# EasyEDA Pro project ProPrj_3x3motorFPGA_2025-06-07.epro, board PCB1
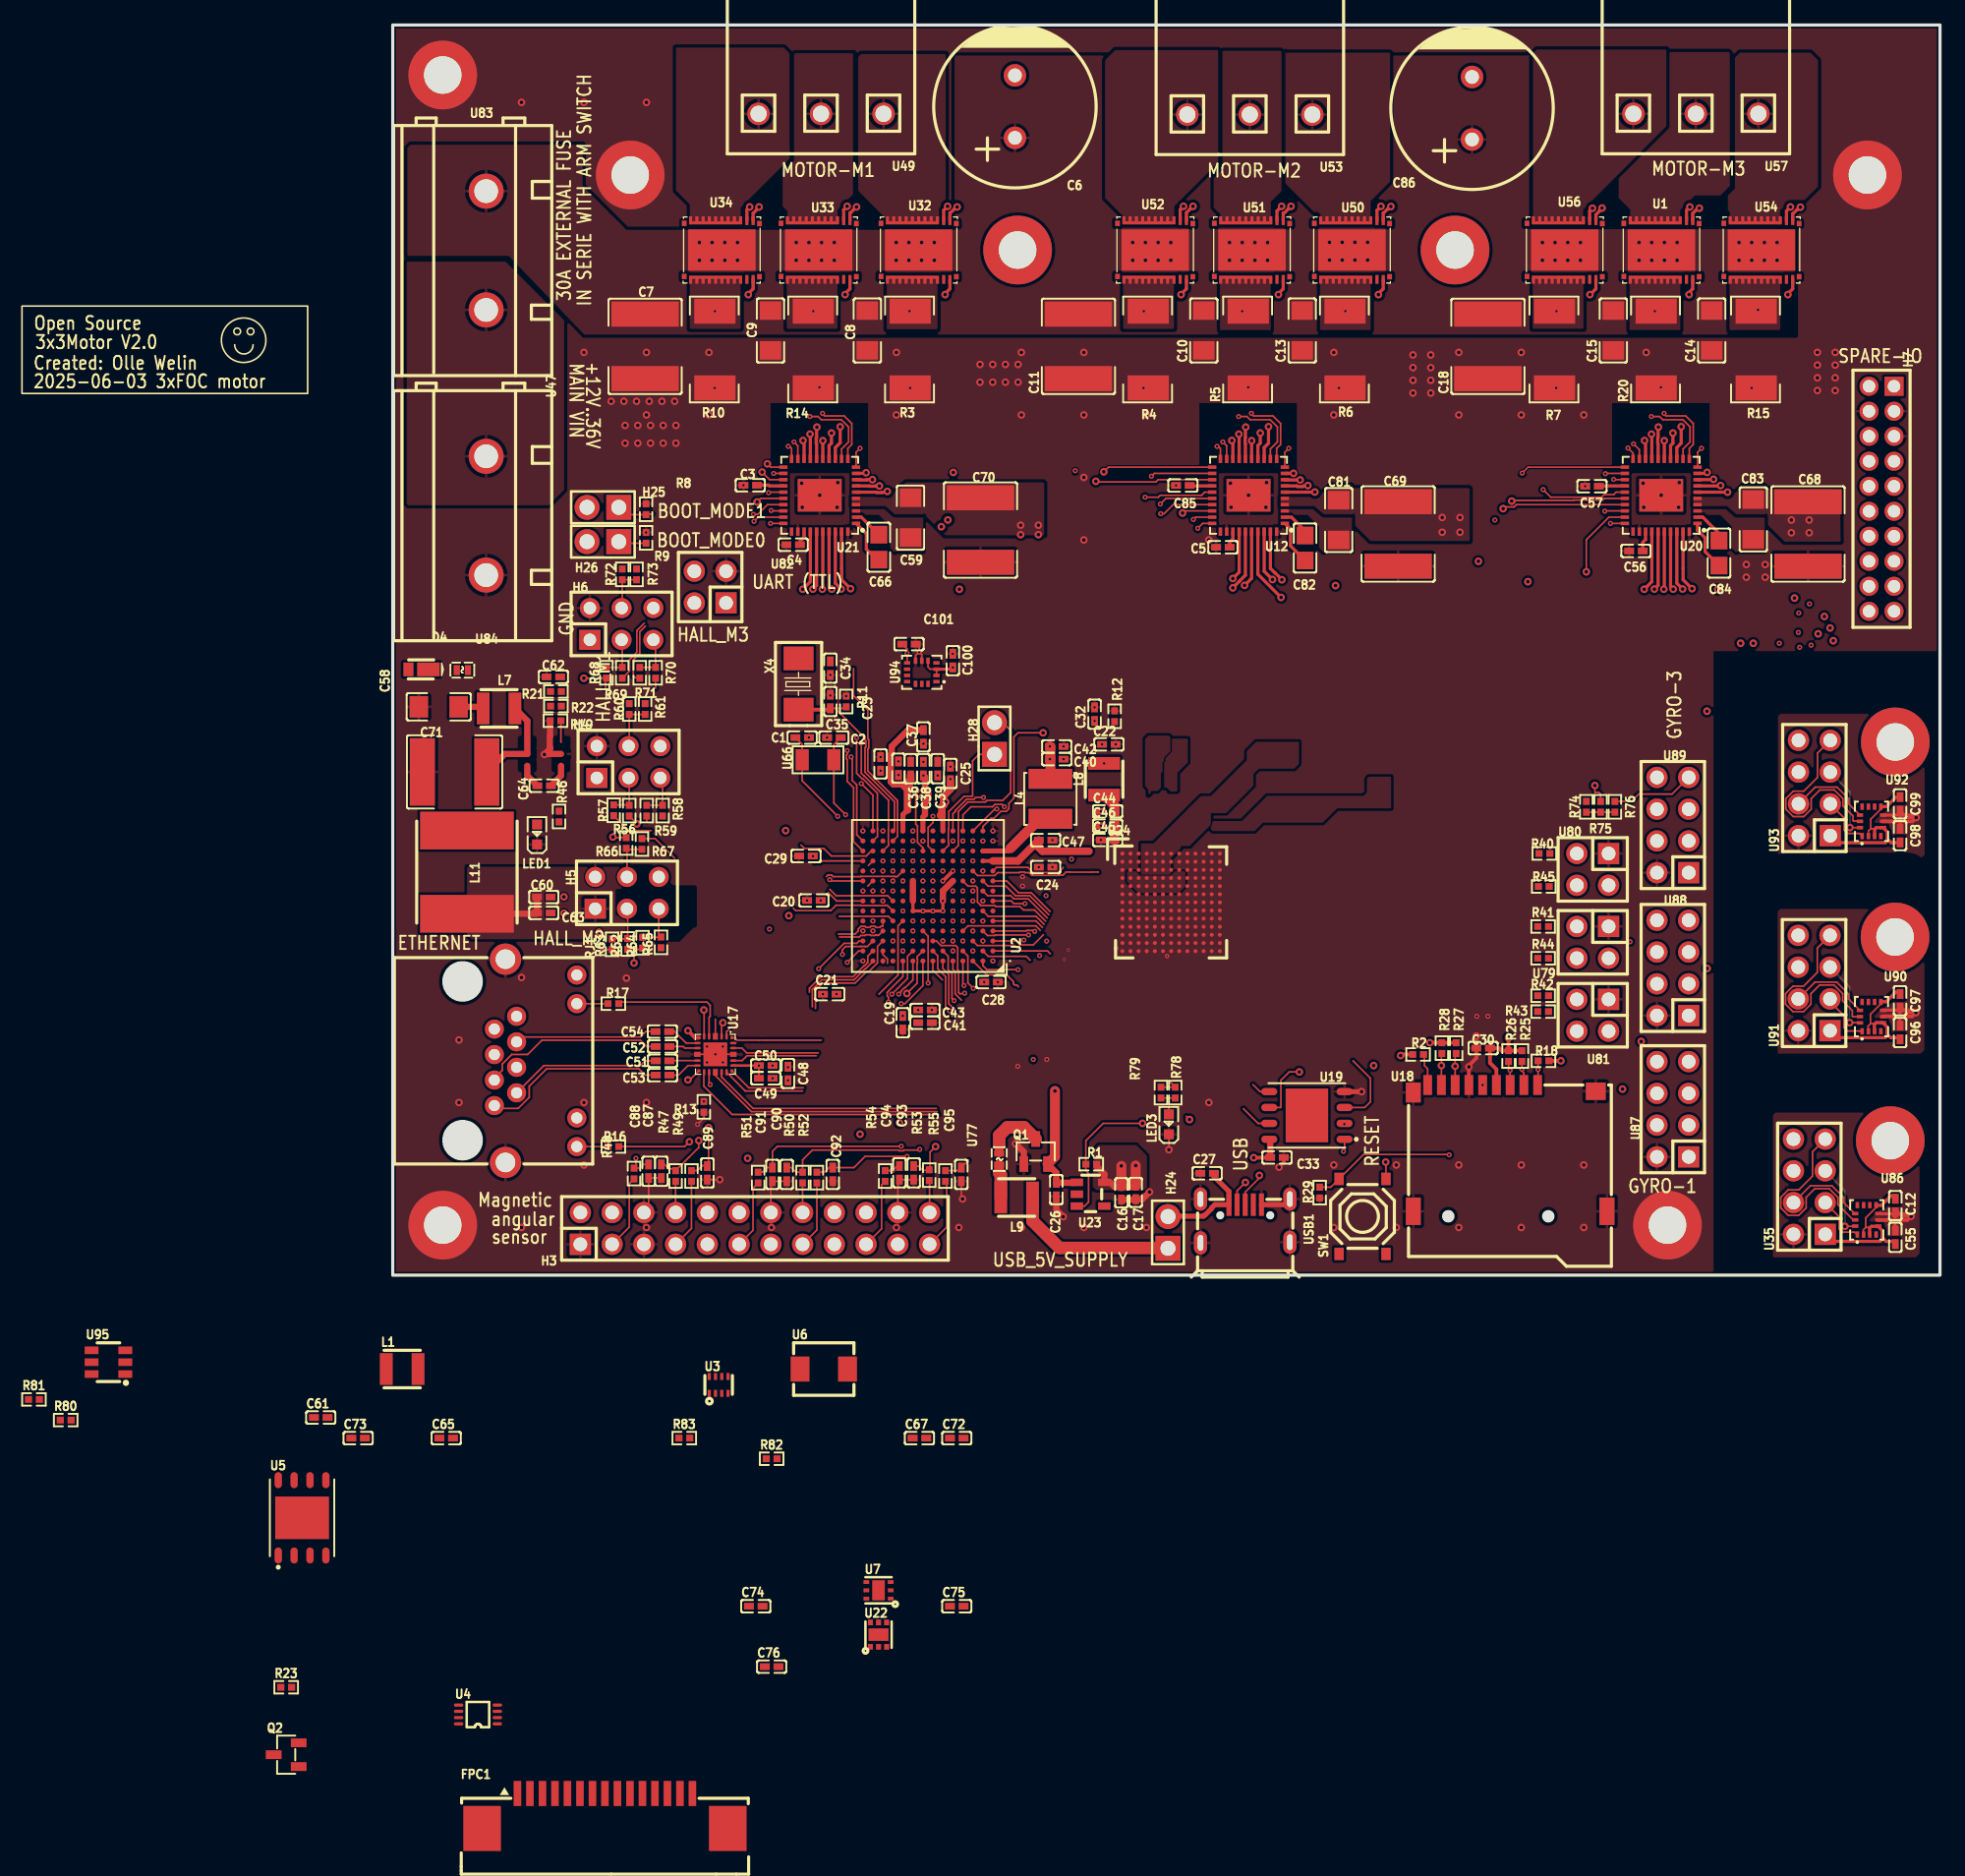
[diagram p5: board, top side]
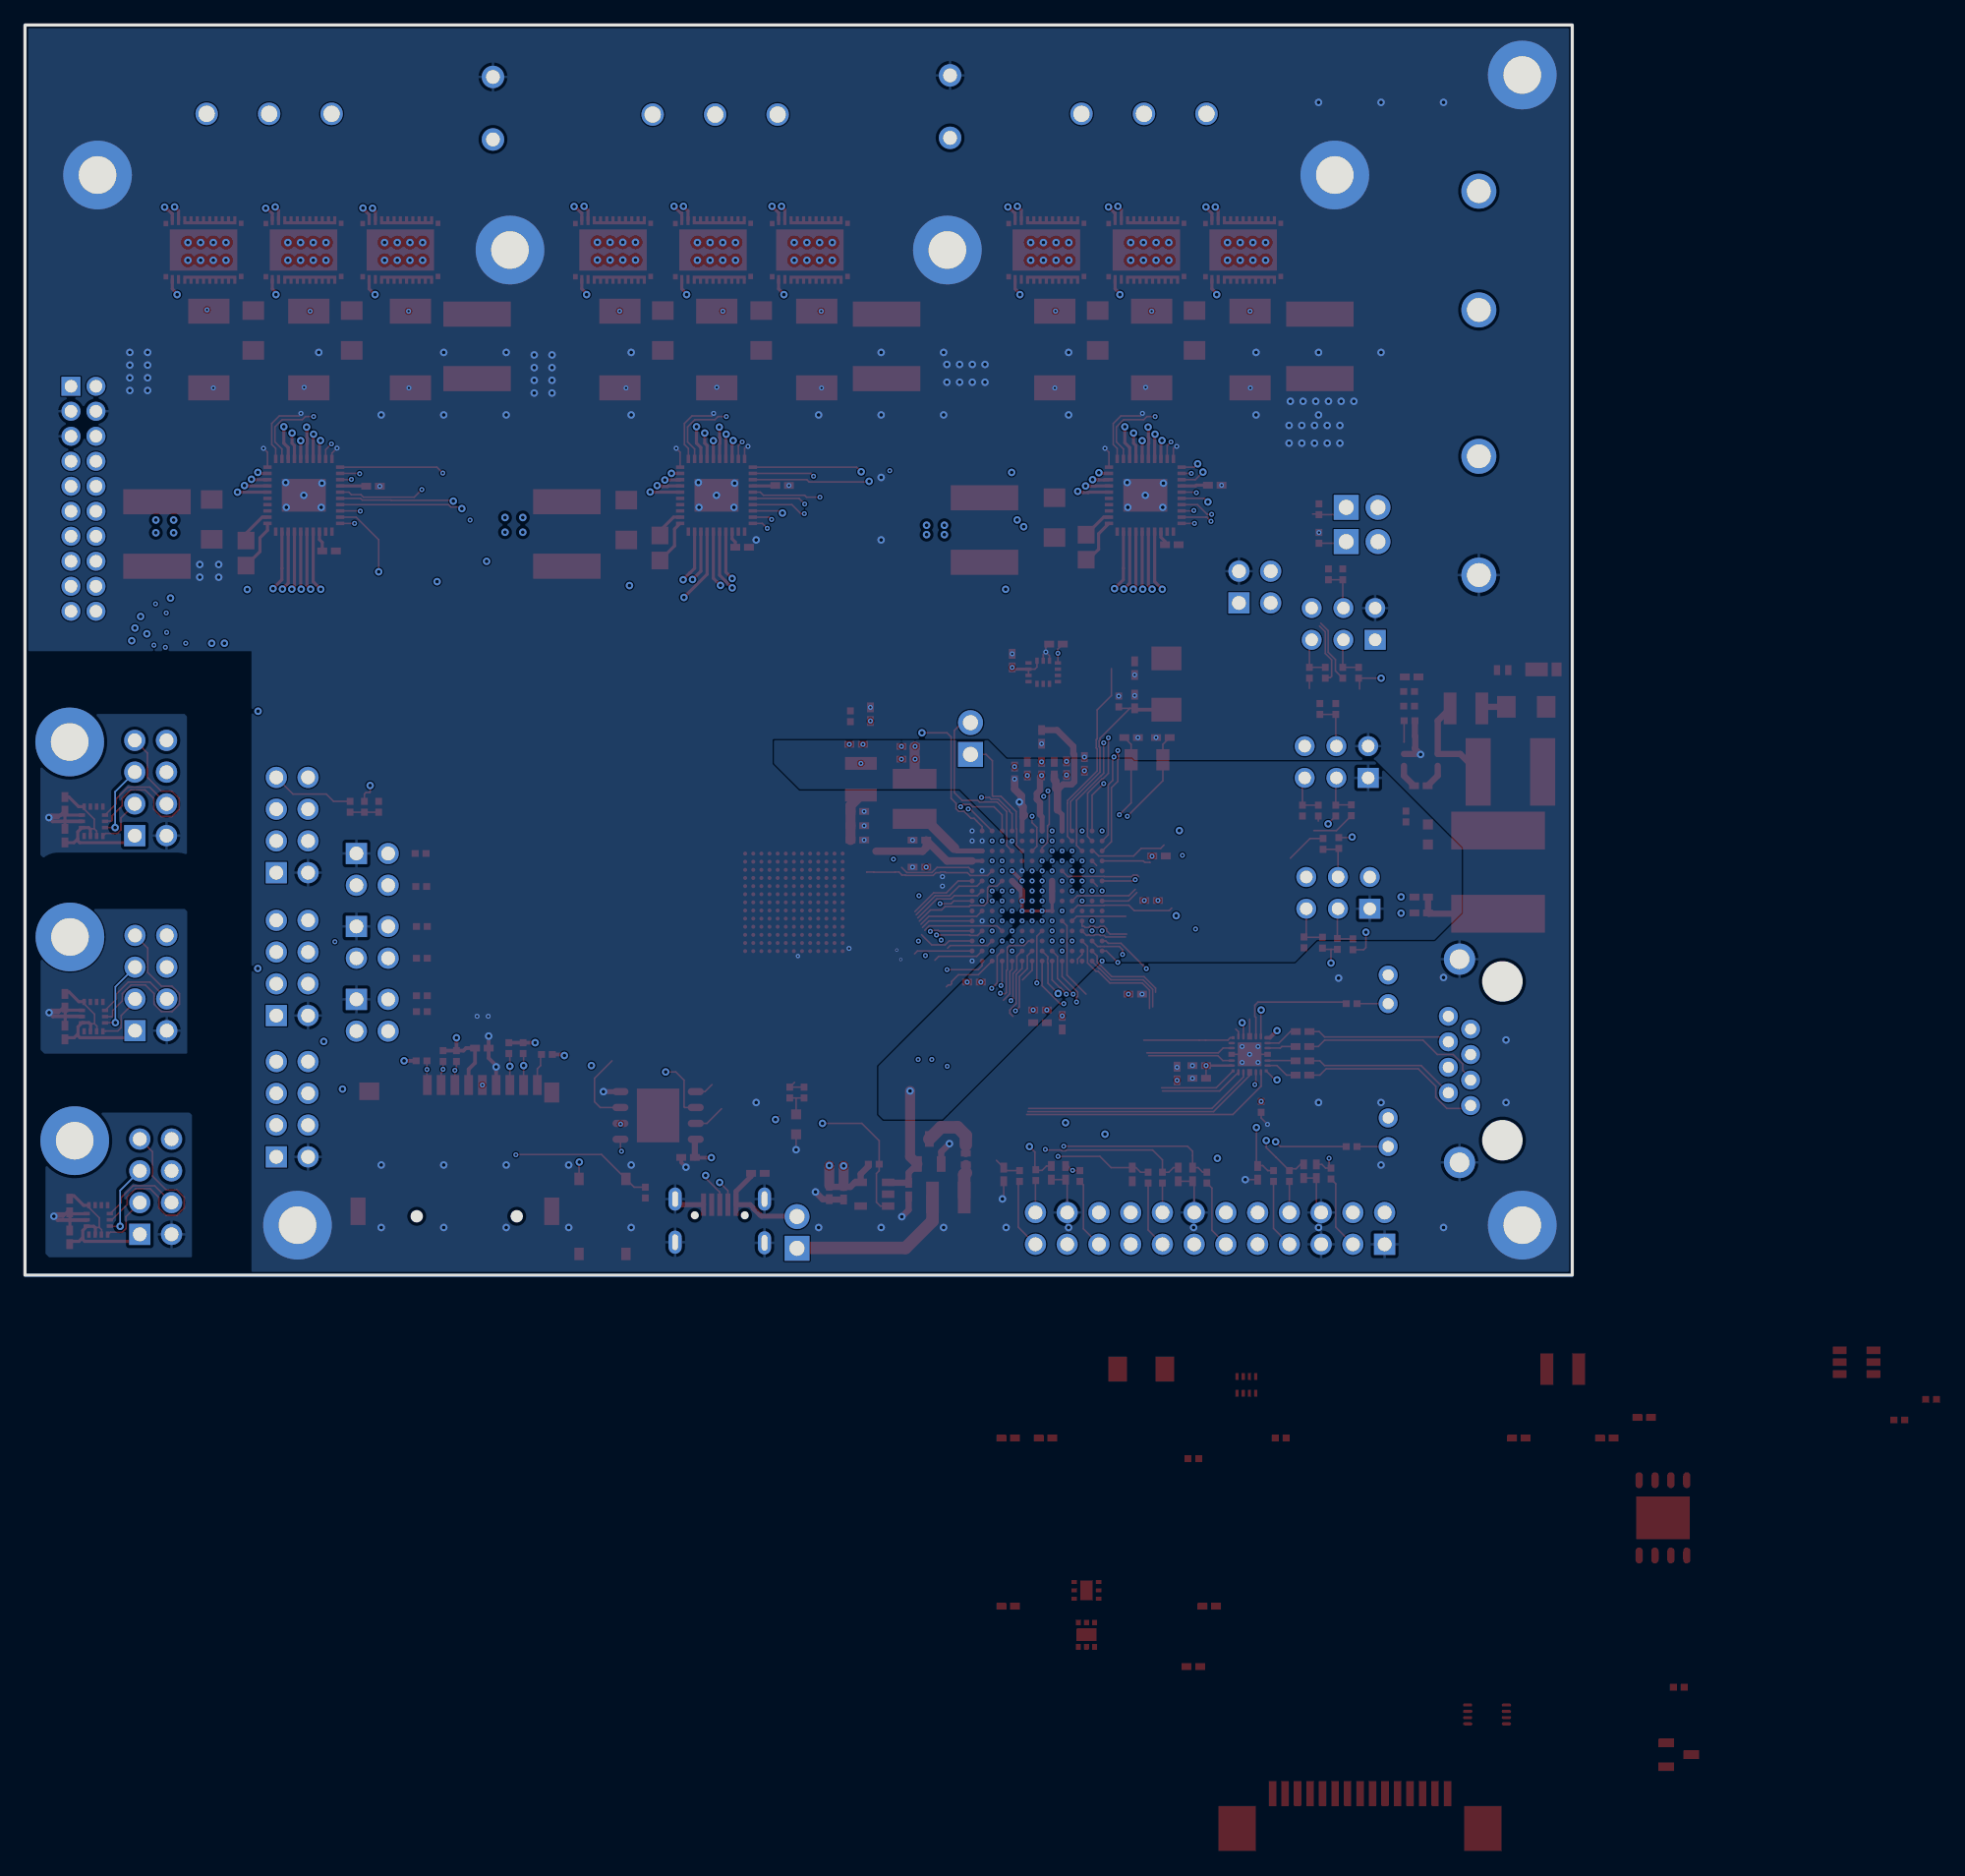
[diagram p6: board, bottom side, seen from below]

Outline 123.81 x 100 mm; copper layers: Top Layer, Inner1, Inner2, Inner3, Inner4, Bottom Layer. Coordinates in mm from the lower left corner of the outline.
Outline path: rectangle 0,100 123.81,0
Stack: Top Layer 0.035mm Outer layer thickness 1oz / Dielectric1 0.0994mm 3313 RC57% 4.2mil / Inner1 0.0152mm Inner layer thickness / Dielectric2 0.55mm 0.55mm H/H No copper / Inner2 0.0152mm Inner layer thickness / Dielectric3 0.1088mm 2116 RC54% 4.9mil / Inner3 0.0152mm Inner layer thickness / Dielectric4 0.55mm 0.55mm H/H No copper / Inner4 0.0152mm Inner layer thickness / Dielectric5 0.0994mm 3313 RC57% 4.2mil / Bottom Layer 0.035mm Outer layer thickness 1oz

## Design rules (mm)
template: Custom Config
spacing copperThickness1oz (default): track to track 0.102, other pairs 0.102 to 0.3
spacing copperThickness2oz: track to track 0.203, other pairs 0.152 to 0.3
track width copperThickness1oz (default): min 0.127, default 0.127, max 2.54
track width copperThickness2oz: min 0.203, default 0.254, max 2.54
differential pair differentialPair (default): width min 0.127, default 0.254, max 2.54; gap min 0.152, default 0.152
differential pair differentialPair100ohm_L1_L2: width min 0.122, default 0.122, max 0.122; gap min 0.203, default 0.203
via viaSize (default): diameter min 0.4, default 0.6, max 10; hole min 0.2, default 0.3, max 6.3
net 36V uses copperRegion_36V
net $1N29938 uses copperRegion_36V
net GND-1 uses copperRegion_36V
net GND-3 uses copperRegion_36V
['net', '36v'] ['NET', '3.3V-1'] uses default
pour e3166 uses copperRegion_36V
pour e3154 uses copperRegion_36V
pour e3189 uses copperRegion_36V
pour e3203 uses copperRegion_36V
pour e3228 uses copperRegion_36V
pour e3209 uses copperRegion_36V
pour e3242 uses copperRegion_36V
pour e3249 uses copperRegion_36V
pour e3261 uses copperRegion_36V
pour e3272 uses copperRegion_36V
pour e9195 uses copperRegion_36V
pour e9346 uses GND_top

## Placement (name value [footprint] x y rotation side)
C1  12pF  [C0402]  32.76 43 0 top
C2  12pF  [C0402]  35.3 43 180 top
C3  100nF  [C0402]  28.61 63.19 180 top
C4  4.7uF  [C0402]  32.04 58.43 180 top
C5  4.7uF  [C0402]  66.42 58.23 180 top
C6  1000uF  [CAP-TH_BD13.0-P5.00-D0.6-FD]  49.78 93.47 90 top
C7  22uF  [C2220]  20.19 74.3 90 top
C8  1uF  [C1206]  37.97 75.56 90 top
C9  1uF  [C1206]  30.23 75.56 90 top
C10  1uF  [C1206]  64.9 75.56 90 top
C11  22uF  [C2220]  54.86 74.3 90 top
C12  4.7uF  [C0402]  120.23 5.57 90 top
C13  1uF  [C1206]  72.77 75.56 90 top
C14  1uF  [C1206]  105.54 75.56 90 top
C15  1uF  [C1206]  97.66 75.56 90 top
C16  4.7uF  [C0402]  58.3 6.59 90 top
C17  4.7uF  [C0402]  59.45 6.62 90 top
C18  22uF  [C2220]  87.63 74.3 90 top
C19  100nF  [C0402]  40.81 20.19 90 top
C20  100nF  [C0402]  33.7 29.97 0 top
C21  100nF  [C0402]  34.97 22.48 0 top
C22  100nF  [C0402]  57.3 42.46 180 top
C23  100nF  [C0402]  39.03 40.89 270 top
C24  100nF  [C0402]  52.24 32.64 180 top
C25  100nF  [C0402]  44.62 40.13 270 top
C26  100nF  [C0402]  53.1 6.84 90 top
C27  4.7uF  [C0402]  65.16 8.15 0 top
C28  100nF  [C0402]  47.87 23.44 180 top
C29  4.7uF  [C0402]  33.06 33.53 0 top
C30  100nF  [C0402]  87.25 18.16 180 top
C31  100nF  [C0402]  40.47 40.55 270 top
C32  100nF  [C0402]  56.16 44.87 90 top
C33  100nF  [C0402]  70.75 9.42 0 top
C34  12pF  [C0402]  35.01 48.55 270 top
C35  12pF  [C0402]  35.01 45.89 90 top
C36  4.7uF  [C0402]  41.44 40.51 270 top
C37  100nF  [C0402]  42.46 43.05 90 top
C38  4.7uF  [C0402]  42.46 40.51 270 top
C39  100nF  [C0402]  43.6 40.51 270 top
C40  4.7uF  [C0402]  53.13 41.28 0 top
C41  4.7uF  [C0402]  42.59 20.19 0 top
C42  4.7uF  [C0402]  53.13 42.29 0 top
C43  100nF  [C0402]  42.59 21.21 0 top
C44  4.7uF  [C0402]  57.2 37.09 180 top
C45  4.7uF  [C0402]  57.2 34.81 180 top
C46  4.7uF  [C0402]  57.2 35.95 180 top
C47  100nF  [C0402]  52.24 34.8 0 top
C48  4.7uF  [C0402]  31.62 16.13 90 top
C49  4.7uF  [C0402]  29.84 15.75 0 top
C50  100nF  [C0402]  29.84 16.76 0 top
C51  33nF  [C0402]  21.59 17.15 0 top
C52  33nF  [C0402]  21.59 18.29 0 top
C53  33nF  [C0402]  21.59 16 0 top
C54  33nF  [C0402]  21.57 19.48 0 top
C55  100nF  [C0402]  120.23 3.03 270 top
C56  4.7uF  [C0402]  99.47 57.93 180 top
C57  100nF  [C0402]  95.96 63.11 180 top
C58  1uF  [C1206]  3.68 45.46 0 top
C59  1uF  [C1206]  41.43 60.59 90 top
C60  4.7uF  [C0402]  12.09 30.24 0 top
C61  100nF  [C0402]  -5.76 -11.39 0 top
C62  4.7uF  [C0402]  12.85 47.85 180 top
C63  4.7uF  [C0402]  12.09 28.97 0 top
C64  100nF  [C0402]  12.12 39.15 0 top
C65  4.7uF  [C0402]  4.28 -13.03 0 top
C66  22nF  [C0805]  38.9 58.23 90 top
C67  4.7uF  [C0402]  42.14 -13.03 0 top
C68  22uF  [C2220]  113.24 59.28 270 top
C69  22uF  [C2220]  80.45 59.29 270 top
C70  22uF  [C2220]  47.03 59.6 270 top
C71  22uF  [C2220]  4.95 40.25 0 top
C72  4.7uF  [C0402]  45.13 -13.03 0 top
C73  100nF  [C0402]  -2.77 -13.03 0 top
C74  100nF  [C0402]  29.05 -26.48 0 top
C75  4.7uF  [C0402]  45.13 -26.48 0 top
C76  100nF  [C0402]  30.32 -31.32 0 top
C81  1uF  [C1206]  75.69 60.4 90 top
C82  22nF  [C0805]  73 58.17 90 top
C83  1uF  [C1206]  108.86 60.45 90 top
C84  22nF  [C0805]  106.12 57.76 90 top
C85  100nF  [C0402]  63.22 63.17 180 top
C86  1000uF  [CAP-TH_BD13.0-P5.00-D0.6-FD]  86.36 93.34 90 top
C87  4.7nF  [C0402]  21.49 8.31 270 top
C88  4.7nF  [C0402]  20.47 8.31 270 top
C89  4.7nF  [C0402]  25.17 8.18 270 top
C90  4.7nF  [C0402]  31.52 8.06 270 top
C91  4.7nF  [C0402]  30.38 8.06 270 top
C92  4.7nF  [C0402]  35.21 8.06 270 top
C93  4.7nF  [C0402]  41.68 8.18 270 top
C94  4.7nF  [C0402]  40.54 8.18 270 top
C95  4.7nF  [C0402]  45.49 8.06 270 top
C96  100nF  [C0402]  120.61 19.41 270 top
C97  4.7uF  [C0402]  120.61 21.95 90 top
C98  100nF  [C0402]  120.61 35.16 270 top
C99  4.7uF  [C0402]  120.61 37.7 90 top
C100  100nF  [C0402]  44.82 49.16 270 top
C101  4.7uF  [C0402]  41.31 50.48 180 top
D4  RB160VAM-60TR  [TUMD2M_L2.0-W1.4-LS2.5-RD]  2.05 48.46 180 top
FPC1  1-84952-5  [FPC-SMD_15P-P1.00_TE_1-84952-5]  16.98 -42.86 0 top
H3  HX PZ2.54-2x12P ZZ  [HDR-TH_24P-P2.54-V-M-R2-C12-S2.54]  28.98 3.74 0 top
H4  排母/2.54mm2x3直排母袋装环保  [HDR-TH_6P-P2.54-V-F-R2-C3-S2.54]  18.87 41.05 0 top
H5  排母/2.54mm2x3直排母袋装环保  [HDR-TH_6P-P2.54-V-F-R2-C3-S2.54]  18.74 30.58 0 top
H6  排母/2.54mm2x3直排母袋装环保  [HDR-TH_6P-P2.54-V-F-R2-C3-S2.54]  18.31 52.09 0 top
H7  2.0-210-SMT-Pin  [HDR-TH_20P-P2.00-V-F-R2-C10-S2.00]  119.13 62.1 270 top
H24  PZ254-1-02-Z-8.5  [HDR-TH_2P-P2.54-V-M]  62.03 3.42 90 top
H25  PZ254-1-02-Z-8.5  [HDR-TH_2P-P2.54-V-M]  16.81 61.42 180 top
H26  PZ254-1-02-Z-8.5  [HDR-TH_2P-P2.54-V-M]  16.81 58.67 180 top
H28  PZ254-1-02-Z-8.5  [HDR-TH_2P-P2.54-V-M]  48.15 42.93 90 top
L1  120nH  [IND-SMD_L2.9-W2.5]  0.75 -7.51 0 top
L4  4.7uH  [IND-SMD_L4.0-W4.0]  52.62 38.1 90 top
L7  120nH  [IND-SMD_L2.9-W2.5]  8.5 45.33 180 top
L8  120nH  [IND-SMD_L2.9-W2.5]  56.92 39.67 90 top
L9  120nH  [IND-SMD_L2.9-W2.5]  49.92 6.21 180 top
L11  33uH  [IND-SMD_L8.0-W8.0]  5.94 32.24 90 top
LED1  KT-0603R  [LED0603-RD]  11.55 35.25 90 top
LED3  KT-0603R  [LED0603-RD]  62.1 12.06 90 top
NOREF  -  [Pad_e320]  120.23 42.65 90 top
NOREF#2  -  [Pad_e323]  119.83 10.76 90 top
NOREF#3  -  [Pad_e238]  4 96 0 top
NOREF#4  -  [Pad_e93]  85 82 0 top
NOREF#5  -  [Pad_e39]  50 82 0 top
NOREF#6  -  [Pad_e242]  4 4 0 top
NOREF#7  -  [Pad_e240]  102 4 0 top
NOREF#8  -  [Pad_e94]  118 88 0 top
NOREF#9  -  [Pad_e32]  19 88 0 top
NOREF#10  -  [Pad_e321]  120.21 27.05 90 top
Q1  DMG2305UX-7  [SOT-23-3_L2.9-W1.3-P1.90-LS2.4-BR]  51.44 9.89 270 top
Q2  BSS138  [SOT-23-3_L2.9-W1.3-P1.90-LS2.4-BR-1]  -8.53 -38.36 0 top
R1  100kΩ  [R0402]  55.89 8.88 0 top
R2  100kΩ  [R0402]  82.04 17.65 180 top
R3  20mΩ  [RES-SMD_L6.4-W3.2-R2512]  41.4 74.04 90 top
R4  20mΩ  [RES-SMD_L6.4-W3.2-R2512]  60.45 74.04 90 top
R5  20mΩ  [RES-SMD_L6.4-W3.2-R2512]  68.45 74.04 90 top
R6  20mΩ  [RES-SMD_L6.4-W3.2-R2512]  76.2 74.04 90 top
R7  20mΩ  [RES-SMD_L6.4-W3.2-R2512]  92.96 74.04 90 top
R8  47kΩ  [R0402]  20.27 61.27 90 top
R9  47kΩ  [R0402]  20.27 58.98 270 top
R10  20mΩ  [RES-SMD_L6.4-W3.2-R2512]  25.78 74.04 90 top
R11  2.2MΩ  [R0402]  36.28 45.89 90 top
R12  1kΩ  [R0402]  57.76 44.7 270 top
R13  6.49kΩ  [R0402]  24.89 13.46 90 top
R14  20mΩ  [RES-SMD_L6.4-W3.2-R2512]  33.66 74.04 90 top
R15  20mΩ  [RES-SMD_L6.4-W3.2-R2512]  109.09 74.04 90 top
R16  150Ω  [R0402]  17.65 10.29 0 top
R17  150Ω  [R0402]  17.65 21.72 0 top
R18  47kΩ  [R0402]  92.07 17.15 0 top
R19  20kΩ  [R0402]  13.02 44.35 0 top
R20  20mΩ  [RES-SMD_L6.4-W3.2-R2512]  101.09 74.04 90 top
R21  100kΩ  [R0402]  13.06 46.69 0 top
R22  4.7kΩ  [R0402]  13.06 45.52 180 top
R23  4.7kΩ  [R0402]  -8.53 -32.97 0 top
R25  47kΩ  [R0402]  90.35 17.53 90 top
R26  47kΩ  [R0402]  89.28 17.53 90 top
R27  47kΩ  [R0402]  85.09 18.16 90 top
R28  47kΩ  [R0402]  83.95 18.16 90 top
R29  47kΩ  [R0402]  74.17 6.6 90 top
R40  1kΩ  [R0402]  92.15 33.73 0 top
R41  1kΩ  [R0402]  92.05 27.89 0 top
R42  1kΩ  [R0402]  92.05 22.35 0 top
R43  1kΩ  [R0402]  92.05 21.08 0 top
R44  1kΩ  [R0402]  92.05 25.35 0 top
R45  1kΩ  [R0402]  92.1 31.09 0 top
R46  1kΩ  [R0402]  13.31 36.69 270 top
R47  4.7kΩ  [R0402]  22.63 7.93 270 top
R48  4.7kΩ  [R0402]  19.3 8.13 270 top
R49  4.7kΩ  [R0402]  23.9 7.93 270 top
R50  4.7kΩ  [R0402]  32.79 7.8 270 top
R51  4.7kΩ  [R0402]  29.24 7.8 270 top
R52  4.7kΩ  [R0402]  33.94 7.8 270 top
R53  4.7kΩ  [R0402]  42.93 8 270 top
R54  4.7kΩ  [R0402]  39.4 7.93 270 top
R55  4.7kΩ  [R0402]  44.22 7.93 270 top
R56  4.7kΩ  [R0402]  18.92 37.16 270 top
R57  1kΩ  [R0402]  17.68 37.19 90 top
R58  4.7kΩ  [R0402]  21.59 37.16 270 top
R59  1kΩ  [R0402]  20.32 37.16 90 top
R60  4.7kΩ  [R0402]  18.92 45.29 90 top
R61  1kΩ  [R0402]  20.19 45.29 270 top
R62  4.7kΩ  [R0402]  18.8 26.49 270 top
R63  1kΩ  [R0402]  17.55 26.46 90 top
R64  4.7kΩ  [R0402]  19.99 26.59 270 top
R65  1kΩ  [R0402]  21.46 26.62 90 top
R66  4.7kΩ  [R0402]  18.68 34.57 90 top
R67  1kΩ  [R0402]  19.94 34.49 270 top
R68  4.7kΩ  [R0402]  17.09 48.18 270 top
R69  1kΩ  [R0402]  18.36 48.18 90 top
R70  4.7kΩ  [R0402]  21.03 48.18 270 top
R71  1kΩ  [R0402]  19.76 48.18 90 top
R72  4.7kΩ  [R0402]  18.36 56.06 90 top
R73  1kΩ  [R0402]  19.51 56.06 270 top
R74  4.7kΩ  [R0402]  95.5 37.47 90 top
R75  4.7kΩ  [R0402]  96.65 37.47 90 top
R76  4.7kΩ  [R0402]  97.79 37.47 90 top
R78  1kΩ  [R0402]  62.61 14.6 270 top
R79  1kΩ  [R0402]  61.47 14.6 270 top
R80  22Ω  [R0402]  -26.17 -11.59 0 top
R81  22Ω  [R0402]  -28.71 -9.94 0 top
R82  10kΩ  [R0402]  30.32 -14.69 0 top
R83  4.7kΩ  [R0402]  23.33 -13.03 0 top
RJ1  RJHSE5384  [RJ45-TH_RJHSE5384]  11.43 17.15 270 top
SW1  TS-1187A-B-A-B  [SW-SMD_4P-L5.1-W5.1-P3.70-LS6.5-TL_H1.5]  77.6 4.7 90 top
U1  CSD88599Q5DC  [SON-22_L5.0-W6.0-P0.50-CSD88599Q5DCT]  101.52 82 270 top
U2  MIMXRT1062DVJ6B  [LFBGA-196_L12.0-W12.0-R14-C14-P0.80-BL]  42.82 30.33 90 top
U3  TPS62840DLCR  [VSON-8_L2.0-W1.5-P0.50-BL]  26.08 -8.78 0 top
U4  PCA9306DC1  [VSSOP-8_L2.4-W2.1-P0.50-LS3.2-BR]  6.82 -35.14 0 top
U5  W25Q64JVZPIQ  [WSON-8_L6.0-W5.0-P1.27-BL-EP]  -7.26 -19.41 0 top
U6  2.2uH  [IND-SMD_L4.7-W4.2]  34.49 -7.51 0 top
U7  TLV75518PDRVR  [WSON-6_L2.0-W2.0-P0.65-BR-EP]  38.87 -25.21 0 top
U12  DRV8304SRHAR  [VQFN-40_L6.0-W6.0-P0.50-TL-EP]  68.47 62.38 180 top
U17  DP83825IRMQR  [HVQFN-24_L3.0-W3.0-P0.40-TL-EP1.9]  25.81 17.66 270 top
U18  A-MicroTF-1.85A  [TF-SMD_A-MICROTF-1.85A]  89.41 10.16 0 top
U19  W25Q64JVZPIQ  [WSON-8_L6.0-W5.0-P1.27-BL-EP]  73.15 12.78 90 top
U20  DRV8304SRHAR  [VQFN-40_L6.0-W6.0-P0.50-TL-EP]  101.5 62.38 180 top
U21  DRV8304SRHAR  [VQFN-40_L6.0-W6.0-P0.50-TL-EP]  34.16 62.38 180 top
U22  TLV75525PDRVR  [WSON-6_L2.0-W2.0-P0.65-BL-EP]  38.87 -28.76 0 top
U23  TLV75733PDBVR  [SOT-23-5_L2.9-W1.6-P0.95-LS2.8-BL]  55.84 6.47 270 top
U24  T20F169C4  [FBGA-169_L9.0-W9.0-R13-C13-P0.65-TL]  62.28 29.82 0 top
U32  CSD88599Q5DC  [SON-22_L5.0-W6.0-P0.50-CSD88599Q5DCT]  42.08 82 270 top
U33  CSD88599Q5DC  [SON-22_L5.0-W6.0-P0.50-CSD88599Q5DCT]  34.08 82 270 top
U34  CSD88599Q5DC  [SON-22_L5.0-W6.0-P0.50-CSD88599Q5DCT]  26.33 82 270 top
U35  PZ2.54-2*4  [HDR-TH_8P-P2.54-V-M-R2-C4-S2.54]  113.35 7.07 90 top
U47  MX950T-9.5-02P-GN01-Cu-PS-A  [CONN-TH_2P-P9.50_DB910-9.52-2P]  7.47 60.75 270 top
U49  KF332K-5.0-3P  [CONN-TH_KF332K-5.0-3P]  34.27 92.9 180 top
U50  CSD88599Q5DC  [SON-22_L5.0-W6.0-P0.50-CSD88599Q5DCT]  76.75 82 270 top
U51  CSD88599Q5DC  [SON-22_L5.0-W6.0-P0.50-CSD88599Q5DCT]  68.75 82 270 top
U52  CSD88599Q5DC  [SON-22_L5.0-W6.0-P0.50-CSD88599Q5DCT]  61 82 270 top
U53  KF332K-5.0-3P  [CONN-TH_KF332K-5.0-3P]  68.58 92.84 180 top
U54  CSD88599Q5DC  [SON-22_L5.0-W6.0-P0.50-CSD88599Q5DCT]  109.52 82 270 top
U56  CSD88599Q5DC  [SON-22_L5.0-W6.0-P0.50-CSD88599Q5DCT]  93.77 82 270 top
U57  KF332K-5.0-3P  [CONN-TH_KF332K-5.0-3P]  104.27 92.9 180 top
U66  32.768kHz  [CRYSTAL-SMD_L3.2-W1.5-2]  34.03 41.22 0 top
U77  0ABA-0500-TN  [F0402]  48.53 9.29 270 top
U79  PZ2.54-2*2  [HDR-TH_4P-P2.54-V-M-R2-C2-S2.54]  96.02 26.62 180 top
U80  PZ2.54-2*2  [HDR-TH_4P-P2.54-V-M-R2-C2-S2.54]  96.02 32.46 180 top
U81  PZ2.54-2*2  [HDR-TH_4P-P2.54-V-M-R2-C2-S2.54]  96.02 20.79 180 top
U82  PZ2.54-2*2  [HDR-TH_4P-P2.54-V-M-R2-C2-S2.54]  25.4 55.04 90 top
U83  MX950T-9.5-02P-GN01-Cu-PS-A  [CONN-TH_2P-P9.50_DB910-9.52-2P]  7.47 81.96 270 top
U84  0ABA-0500-TN  [F0402]  5.57 48.4 0 top
U86  ASM330LHHTR  [LGA-14L_L3.0-W2.5-P0.50-TL]  117.94 4.42 90 top
U87  PZ2.54-2*4  [HDR-TH_8P-P2.54-V-M-R2-C4-S2.54]  102.43 13.27 90 top
U88  PZ2.54-2*4  [HDR-TH_8P-P2.54-V-M-R2-C4-S2.54]  102.43 24.57 90 top
U89  PZ2.54-2*4  [HDR-TH_8P-P2.54-V-M-R2-C4-S2.54]  102.43 36 90 top
U90  ASM330LHHTR  [LGA-14L_L3.0-W2.5-P0.50-TL]  118.32 20.68 90 top
U91  PZ2.54-2*4  [HDR-TH_8P-P2.54-V-M-R2-C4-S2.54]  113.73 23.37 90 top
U92  ASM330LHHTR  [LGA-14L_L3.0-W2.5-P0.50-TL]  118.32 36.3 90 top
U93  PZ2.54-2*4  [HDR-TH_8P-P2.54-V-M-R2-C4-S2.54]  113.75 38.97 90 top
U94  ASM330LHHTR  [LGA-14L_L3.0-W2.5-P0.50-TL]  42.33 48.22 180 top
U95  LMR51610XDBVR  [SOT-23-6_L2.9-W1.6-P0.95-LS2.8-BR]  -22.75 -6.96 0 top
USB1  051N-4BH806-S  [MICRO-USB-SMD_051N-4BH806-S]  68.21 4.34 0 top
X4  24MHz  [OSC-SMD_L5.0-W3.2]  32.47 47.28 270 top

## Footprints (pads in the part's own frame, mm; a bottom-side part is the same pattern mirrored in y, then rotated)
C0402
  rect 0.79x0.54 smd: 1(-0.545,0) 2(0.545,0)
C0805
  rect 1.41x1.35 smd: 1(-1,0) 2(1,0)
C1206
  rect 1.485x1.728 smd: 1(-1.593,0) 2(1.593,0)
C2220
  rect 2.01x5.4 smd: 1(-2.58,0) 2(2.58,0)
CAP-TH_BD13.0-P5.00-D0.6-FD
  round 1.8 hole 1.1: 1(-2.5,0) 2(2.5,0)
CONN-TH_2P-P9.50_DB910-9.52-2P
  round 2.8 hole 1.9: 1(-4.75,0) 2(4.75,0)
CONN-TH_KF332K-5.0-3P
  round 1.8 hole 1.3: 1(-5,0) 2(0,0) 3(5,0)
CRYSTAL-SMD_L3.2-W1.5-2
  rect 1.05x1.7 smd: 1(-1.27,0) 2(1.27,0)
F0402
  rect 0.5x0.8 smd: 1(-0.45,0) 2(0.45,0)
FBGA-169_L9.0-W9.0-R13-C13-P0.65-TL
  round 0.32 smd: A1(-3.9,3.9) A2(-3.25,3.9) A3(-2.6,3.9) A4(-1.95,3.9) A5(-1.3,3.9) A6(-0.65,3.9) A7(0,3.9) A8(0.65,3.9) A9(1.3,3.9) A10(1.95,3.9) A11(2.6,3.9) A12(3.25,3.9) A13(3.9,3.9) B1(-3.9,3.25) B2(-3.25,3.25) B3(-2.6,3.25) B4(-1.95,3.25) B5(-1.3,3.25) B6(-0.65,3.25) B7(0,3.25) B8(0.65,3.25) B9(1.3,3.25) B10(1.95,3.25) B11(2.6,3.25) B12(3.25,3.25) B13(3.9,3.25) C1(-3.9,2.6) C2(-3.25,2.6) C3(-2.6,2.6) C4(-1.95,2.6) C5(-1.3,2.6) C6(-0.65,2.6) C7(0,2.6) C8(0.65,2.6) C9(1.3,2.6) C10(1.95,2.6) C11(2.6,2.6) C12(3.25,2.6) C13(3.9,2.6) D1(-3.9,1.95) D2(-3.25,1.95) D3(-2.6,1.95) D4(-1.95,1.95) D5(-1.3,1.95) D6(-0.65,1.95) D7(0,1.95) D8(0.65,1.95) D9(1.3,1.95) D10(1.95,1.95) D11(2.6,1.95) D12(3.25,1.95) D13(3.9,1.95) E1(-3.9,1.3) E2(-3.25,1.3) E3(-2.6,1.3) E4(-1.95,1.3) E5(-1.3,1.3) E6(-0.65,1.3) E7(0,1.3) E8(0.65,1.3) E9(1.3,1.3) E10(1.95,1.3) E11(2.6,1.3) E12(3.25,1.3) E13(3.9,1.3) F1(-3.9,0.65) F2(-3.25,0.65) F3(-2.6,0.65) F4(-1.95,0.65) F5(-1.3,0.65) F6(-0.65,0.65) F7(0,0.65) F8(0.65,0.65) F9(1.3,0.65) F10(1.95,0.65) F11(2.6,0.65) F12(3.25,0.65) F13(3.9,0.65) G1(-3.9,0) G2(-3.25,0) G3(-2.6,0) G4(-1.95,0) G5(-1.3,0) G6(-0.65,0) G7(0,0) G8(0.65,0) G9(1.3,0) G10(1.95,0) G11(2.6,0) G12(3.25,0) G13(3.9,0) H1(-3.9,-0.65) H2(-3.25,-0.65) H3(-2.6,-0.65) H4(-1.95,-0.65) H5(-1.3,-0.65) H6(-0.65,-0.65) H7(0,-0.65) H8(0.65,-0.65) H9(1.3,-0.65) H10(1.95,-0.65) H11(2.6,-0.65) H12(3.25,-0.65) H13(3.9,-0.65) J1(-3.9,-1.3) J2(-3.25,-1.3) J3(-2.6,-1.3) J4(-1.95,-1.3) J5(-1.3,-1.3) J6(-0.65,-1.3) J7(0,-1.3) J8(0.65,-1.3) J9(1.3,-1.3) J10(1.95,-1.3) J11(2.6,-1.3) J12(3.25,-1.3) J13(3.9,-1.3) K1(-3.9,-1.95) K2(-3.25,-1.95) K3(-2.6,-1.95) K4(-1.95,-1.95) K5(-1.3,-1.95) K6(-0.65,-1.95) K7(0,-1.95) K8(0.65,-1.95) K9(1.3,-1.95) K10(1.95,-1.95) K11(2.6,-1.95) K12(3.25,-1.95) K13(3.9,-1.95) L1(-3.9,-2.6) L2(-3.25,-2.6) L3(-2.6,-2.6) L4(-1.95,-2.6) L5(-1.3,-2.6) L6(-0.65,-2.6) L7(0,-2.6) L8(0.65,-2.6) L9(1.3,-2.6) L10(1.95,-2.6) L11(2.6,-2.6) L12(3.25,-2.6) L13(3.9,-2.6) M1(-3.9,-3.25) M2(-3.25,-3.25) M3(-2.6,-3.25) M4(-1.95,-3.25) M5(-1.3,-3.25) M6(-0.65,-3.25) M7(0,-3.25) M8(0.65,-3.25) M9(1.3,-3.25) M10(1.95,-3.25) M11(2.6,-3.25) M12(3.25,-3.25) M13(3.9,-3.25) N1(-3.9,-3.9) N2(-3.25,-3.9) N3(-2.6,-3.9) N4(-1.95,-3.9) N5(-1.3,-3.9) N6(-0.65,-3.9) N7(0,-3.9) N8(0.65,-3.9) N9(1.3,-3.9) N10(1.95,-3.9) N11(2.6,-3.9) N12(3.25,-3.9) N13(3.9,-3.9)
FPC-SMD_15P-P1.00_TE_1-84952-5
  rect 0.6x2 smd: 1(-7,1.4) 2(-6,1.4) 3(-5,1.4) 4(-4,1.4) 5(-3,1.4) 6(-2,1.4) 7(-1,1.4) 8(0,1.4) 9(1,1.4) 10(2,1.4) 11(3,1.4) 12(4,1.4) 13(5,1.4) 14(6,1.4) 15(7,1.4)
  rect 3x3.6 smd: 16(9.83,-1.4) 17(-9.83,-1.4)
HDR-TH_2P-P2.54-V-M
  rect 2x2 hole 1.2: 1(-1.27,0)
  round 2 hole 1.2: 2(1.27,0)
HDR-TH_4P-P2.54-V-M-R2-C2-S2.54
  rect 1.7x1.7 hole 1.1: 1(-1.27,-1.27)
  round 1.7 hole 1.1: 2(-1.27,1.27) 3(1.27,-1.27) 4(1.27,1.27)
HDR-TH_6P-P2.54-V-F-R2-C3-S2.54
  rect 1.7x1.6 hole 1: 1(-2.54,-1.27)
  round 1.6 hole 1: 2(-2.54,1.27) 3(0,-1.27) 4(0,1.27) 5(2.54,-1.27) 6(2.54,1.27)
HDR-TH_8P-P2.54-V-M-R2-C4-S2.54
  rect 1.7x1.7 hole 1.1: 1(-3.81,-1.27)
  round 1.7 hole 1.1: 2(-3.81,1.27) 3(-1.27,-1.27) 4(-1.27,1.27) 5(1.27,-1.27) 6(1.27,1.27) 7(3.81,-1.27) 8(3.81,1.27)
HDR-TH_20P-P2.00-V-F-R2-C10-S2.00
  rect 1.524x1.524 hole 1: 1(-9,1)
  round 1.524 hole 1: 2(-9,-1) 3(-7,1) 4(-7,-1) 5(-5,1) 6(-5,-1) 7(-3,1) 8(-3,-1) 9(-1,1) 10(-1,-1) 11(1,1) 12(1,-1) 13(3,1) 14(3,-1) 15(5,1) 16(5,-1) 17(7,1) 18(7,-1) 19(9,1) 20(9,-1)
HDR-TH_24P-P2.54-V-M-R2-C12-S2.54
  rect 1.7x1.7 hole 1.1: 1(-13.97,-1.27)
  round 1.7 hole 1.1: 2(-13.97,1.27) 3(-11.43,-1.27) 4(-11.43,1.27) 5(-8.89,-1.27) 6(-8.89,1.27) 7(-6.35,-1.27) 8(-6.35,1.27) 9(-3.81,-1.27) 10(-3.81,1.27) 11(-1.27,-1.27) 12(-1.27,1.27) 13(1.27,-1.27) 14(1.27,1.27) 15(3.81,-1.27) 16(3.81,1.27) 17(6.35,-1.27) 18(6.35,1.27) 19(8.89,-1.27) 20(8.89,1.27) 21(11.43,-1.27) 22(11.43,1.27) 23(13.97,-1.27) 24(13.97,1.27)
HVQFN-24_L3.0-W3.0-P0.40-TL-EP1.9
  oval 0.525x0.2 smd: 1(-1.438,0.9) 2(-1.438,0.5) 4(-1.438,-0.5) 5(-1.438,-0.9) 13(1.438,-0.9) 14(1.438,-0.5) 16(1.438,0.5) 17(1.438,0.9)
  rect 0.525x0.4 smd: 3(-1.438,0) 15(1.438,0)
  rect 0.25x0.25 smd: 6(-1.325,-1.325) 12(1.325,-1.325) 18(1.325,1.325) 24(-1.325,1.325)
  oval 0.2x0.525 smd: 7(-0.9,-1.438) 8(-0.5,-1.438) 10(0.5,-1.438) 11(0.9,-1.438) 19(0.9,1.438) 20(0.5,1.438) 22(-0.5,1.438) 23(-0.9,1.438)
  rect 0.4x0.525 smd: 9(0,-1.438) 21(0,1.438)
  rect 1.9x1.9 smd: 25(0,0)
IND-SMD_L2.9-W2.5
  rect 1.02x2.54 smd: 1(-1.27,0) 2(1.27,0)
IND-SMD_L4.0-W4.0
  rect 1.6x3.5 smd: 1(-1.6,0) 2(1.6,0)
IND-SMD_L4.7-W4.2
  rect 1.5x2 smd: 1(-1.9,0) 2(1.9,0)
IND-SMD_L8.0-W8.0
  rect 3.024x7.5 smd: 1(3.328,0) 2(-3.328,0)
LED0603-RD
  rect 0.8x0.8 smd: 1(-0.799,0) 2(0.799,0)
LFBGA-196_L12.0-W12.0-R14-C14-P0.80-BL
  round 0.4 smd: A1(-5.2,-5.2) A2(-5.2,-4.4) A3(-5.2,-3.6) A4(-5.2,-2.8) A5(-5.2,-2) A6(-5.2,-1.2) A7(-5.2,-0.4) A8(-5.2,0.4) A9(-5.2,1.2) A10(-5.2,2) A11(-5.2,2.8) A12(-5.2,3.6) A13(-5.2,4.4) A14(-5.2,5.2) B1(-4.4,-5.2) B2(-4.4,-4.4) B3(-4.4,-3.6) B4(-4.4,-2.8) B5(-4.4,-2) B6(-4.4,-1.2) B7(-4.4,-0.4) B8(-4.4,0.4) B9(-4.4,1.2) B10(-4.4,2) B11(-4.4,2.8) B12(-4.4,3.6) B13(-4.4,4.4) B14(-4.4,5.2) C1(-3.6,-5.2) C2(-3.6,-4.4) C3(-3.6,-3.6) C4(-3.6,-2.8) C5(-3.6,-2) C6(-3.6,-1.2) C7(-3.6,-0.4) C8(-3.6,0.4) C9(-3.6,1.2) C10(-3.6,2) C11(-3.6,2.8) C12(-3.6,3.6) C13(-3.6,4.4) C14(-3.6,5.2) D1(-2.8,-5.2) D2(-2.8,-4.4) D3(-2.8,-3.6) D4(-2.8,-2.8) D5(-2.8,-2) D6(-2.8,-1.2) D7(-2.8,-0.4) D8(-2.8,0.4) D9(-2.8,1.2) D10(-2.8,2) D11(-2.8,2.8) D12(-2.8,3.6) D13(-2.8,4.4) D14(-2.8,5.2) E1(-2,-5.2) E2(-2,-4.4) E3(-2,-3.6) E4(-2,-2.8) E5(-2,-2) E6(-2,-1.2) E7(-2,-0.4) E8(-2,0.4) E9(-2,1.2) E10(-2,2) E11(-2,2.8) E12(-2,3.6) E13(-2,4.4) E14(-2,5.2) F1(-1.2,-5.2) F2(-1.2,-4.4) F3(-1.2,-3.6) F4(-1.2,-2.8) F5(-1.2,-2) F6(-1.2,-1.2) F7(-1.2,-0.4) F8(-1.2,0.4) F9(-1.2,1.2) F10(-1.2,2) F11(-1.2,2.8) F12(-1.2,3.6) F13(-1.2,4.4) F14(-1.2,5.2) G1(-0.4,-5.2) G2(-0.4,-4.4) G3(-0.4,-3.6) G4(-0.4,-2.8) G5(-0.4,-2) G6(-0.4,-1.2) G7(-0.4,-0.4) G8(-0.4,0.4) G9(-0.4,1.2) G10(-0.4,2) G11(-0.4,2.8) G12(-0.4,3.6) G13(-0.4,4.4) G14(-0.4,5.2) H1(0.4,-5.2) H2(0.4,-4.4) H3(0.4,-3.6) H4(0.4,-2.8) H5(0.4,-2) H6(0.4,-1.2) H7(0.4,-0.4) H8(0.4,0.4) H9(0.4,1.2) H10(0.4,2) H11(0.4,2.8) H12(0.4,3.6) H13(0.4,4.4) H14(0.4,5.2) J1(1.2,-5.2) J2(1.2,-4.4) J3(1.2,-3.6) J4(1.2,-2.8) J5(1.2,-2) J6(1.2,-1.2) J7(1.2,-0.4) J8(1.2,0.4) J9(1.2,1.2) J10(1.2,2) J11(1.2,2.8) J12(1.2,3.6) J13(1.2,4.4) J14(1.2,5.2) K1(2,-5.2) K2(2,-4.4) K3(2,-3.6) K4(2,-2.8) K5(2,-2) K6(2,-1.2) K7(2,-0.4) K8(2,0.4) K9(2,1.2) K10(2,2) K11(2,2.8) K12(2,3.6) K13(2,4.4) K14(2,5.2) L1(2.8,-5.2) L2(2.8,-4.4) L3(2.8,-3.6) L4(2.8,-2.8) L5(2.8,-2) L6(2.8,-1.2) L7(2.8,-0.4) L8(2.8,0.4) L9(2.8,1.2) L10(2.8,2) L11(2.8,2.8) L12(2.8,3.6) L13(2.8,4.4) L14(2.8,5.2) M1(3.6,-5.2) M2(3.6,-4.4) M3(3.6,-3.6) M4(3.6,-2.8) M5(3.6,-2) M6(3.6,-1.2) M7(3.6,-0.4) M8(3.6,0.4) M9(3.6,1.2) M10(3.6,2) M11(3.6,2.8) M12(3.6,3.6) M13(3.6,4.4) M14(3.6,5.2) N1(4.4,-5.2) N2(4.4,-4.4) N3(4.4,-3.6) N4(4.4,-2.8) N5(4.4,-2) N6(4.4,-1.2) N7(4.4,-0.4) N8(4.4,0.4) N9(4.4,1.2) N10(4.4,2) N11(4.4,2.8) N12(4.4,3.6) N13(4.4,4.4) N14(4.4,5.2) P1(5.2,-5.2) P2(5.2,-4.4) P3(5.2,-3.6) P4(5.2,-2.8) P5(5.2,-2) P6(5.2,-1.2) P7(5.2,-0.4) P8(5.2,0.4) P9(5.2,1.2) P10(5.2,2) P11(5.2,2.8) P12(5.2,3.6) P13(5.2,4.4) P14(5.2,5.2)
LGA-14L_L3.0-W2.5-P0.50-TL
  rect 0.5x0.28 smd: 1(-1.175,0.75) 2(-1.175,0.25) 3(-1.175,-0.25) 4(-1.175,-0.75) 8(1.175,-0.75) 9(1.175,-0.25) 10(1.175,0.25) 11(1.175,0.75)
  rect 0.28x0.5 smd: 5(-0.5,-0.925) 6(0,-0.925) 7(0.5,-0.925) 12(0.5,0.925) 13(0,0.925) 14(-0.5,0.925)
MICRO-USB-SMD_051N-4BH806-S
  rect 0.4x1.8 smd: 1(-1.3,1.3) 2(-0.65,1.3) 3(0,1.3) 4(0.65,1.3) 5(1.3,1.3)
  oval 1.05x1.85 hole 0.45x1.25: 6(-3.575,1.75) 7(-3.575,-1.75) 8(3.575,1.75) 9(3.575,-1.7)
OSC-SMD_L5.0-W3.2
  rect 1.9x2.4 smd: 1(-2.05,0) 2(2.05,0)
Pad_e32
  round 5.5 hole 3: 1(0,0)
Pad_e39
  round 5.5 hole 3: 1(0,0)
Pad_e93
  round 5.5 hole 3: 1(0,0)
Pad_e94
  round 5.5 hole 3: 1(0,0)
Pad_e238
  round 5.5 hole 3: 1(0,0)
Pad_e240
  round 5.5 hole 3: 1(0,0)
Pad_e242
  round 5.5 hole 3: 1(0,0)
Pad_e320
  round 5.5 hole 3: 1(0,0)
Pad_e321
  round 5.5 hole 3: 1(0,0)
Pad_e323
  round 5.5 hole 3: 1(0,0)
R0402
  rect 0.566x0.54 smd: 1(-0.433,0) 2(0.433,0)
RES-SMD_L6.4-W3.2-R2512
  rect 2x3.3 smd: 1(-3.067,0) 2(3.067,0)
RJ45-TH_RJHSE5384
  round 1.524 hole 0.89: 1(3.58,-3.3) 2(2.56,-1.52) 3(1.54,-3.3) 4(0.52,-1.52) 5(-0.5,-3.3) 6(-1.52,-1.52) 7(-2.54,-3.3) 8(-3.56,-1.52) 9(6.86,3.3) 10(4.57,3.3) 11(-4.57,3.3) 12(-6.86,3.3)
  round 2.5 hole 1.57: 13(-8.13,-2.41) 14(8.13,-2.41)
SON-22_L5.0-W6.0-P0.50-CSD88599Q5DCT
  rect 0.7x0.25 smd: 1(-2.35,2.5) 2(-2.35,2) 21(2.35,2) 22(2.35,2.5)
  rect 0.45x0.25 smd: 3(-2.475,1.5) 4(-2.475,1) 5(-2.475,0.5) 6(-2.475,0) 7(-2.475,-0.5) 8(-2.475,-1) 9(-2.475,-1.5) 10(-2.475,-2) 11(-2.475,-2.5) 12(2.475,-2.5) 13(2.475,-2) 14(2.475,-1.5) 15(2.475,-1) 16(2.475,-0.5) 17(2.475,0) 18(2.475,0.5) 19(2.475,1) 20(2.475,1.5)
  rect 0.25x4.25 smd: 11(-2.175,-0.5) 20(2.175,-0.5)
  rect 0.43x0.375 smd: 23(-2.115,3.013) 24(-2.135,-3.013) 25(2.115,-3.013) 26(2.135,3.013)
  rect 3.3x5.4 smd: 27(0,0)
SOT-23-3_L2.9-W1.3-P1.90-LS2.4-BR
  rect 1.25x0.7 smd: 1(1,-0.95) 2(1,0.95) 3(-1,0)
SOT-23-3_L2.9-W1.3-P1.90-LS2.4-BR-1
  rect 1.25x0.7 smd: 1(1,-0.95) 2(1,0.95) 3(-1,0)
SOT-23-5_L2.9-W1.6-P0.95-LS2.8-BL
  rect 0.6x1 smd: 1(-0.95,-1.1) 2(0,-1.1) 3(0.95,-1.1) 4(0.95,1.1) 5(-0.95,1.1)
SOT-23-6_L2.9-W1.6-P0.95-LS2.8-BR
  rect 1.1x0.6 smd: 1(1.35,-0.95) 2(1.35,0) 3(1.35,0.95) 4(-1.35,0.95) 5(-1.35,0) 6(-1.35,-0.95)
SW-SMD_4P-L5.1-W5.1-P3.70-LS6.5-TL_H1.5
  rect 1x0.75 smd: 1(-3,1.875) 2(3,1.875) 3(-3,-1.875) 4(3,-1.875)
TF-SMD_A-MICROTF-1.85A
  rect 0.7x1.6 smd: 1(2.2,5.05) 2(1.1,5.05) 3(0,5.05) 4(-1.1,5.05) 5(-2.2,5.05) 6(-3.3,5.05) 7(-4.4,5.05) 8(-5.5,5.05) 9(-6.6,5.05)
  rect 1.2x1.6 smd: 10(-7.75,4.45)
  rect 1.2x2.2 smd: 10(-7.75,-5.05) 10(7.75,-5.05)
  rect 1.6x1.4 smd: 10(6.85,4.55)
TUMD2M_L2.0-W1.4-LS2.5-RD
  rect 1.8x1.1 smd: 1(-0.8,0)
  rect 0.8x1.1 smd: 2(0.8,0)
VQFN-40_L6.0-W6.0-P0.50-TL-EP
  rect 0.665x0.28 smd: 1(-2.908,2.25) 2(-2.908,1.75) 3(-2.908,1.25) 4(-2.908,0.75) 5(-2.908,0.25) 6(-2.908,-0.25) 7(-2.908,-0.75) 8(-2.908,-1.25) 9(-2.908,-1.75) 10(-2.908,-2.25) 21(2.908,-2.25) 22(2.908,-1.75) 23(2.908,-1.25) 24(2.908,-0.75) 25(2.908,-0.25) 26(2.908,0.25) 27(2.908,0.75) 28(2.908,1.25) 29(2.908,1.75) 30(2.908,2.25)
  rect 0.28x0.665 smd: 11(-2.25,-2.908) 12(-1.75,-2.908) 13(-1.25,-2.908) 14(-0.75,-2.908) 15(-0.25,-2.908) 16(0.25,-2.908) 17(0.75,-2.908) 18(1.25,-2.908) 19(1.75,-2.908) 20(2.25,-2.908) 31(2.25,2.908) 32(1.75,2.908) 33(1.25,2.908) 34(0.75,2.908) 35(0.25,2.908) 36(-0.25,2.908) 37(-0.75,2.908) 38(-1.25,2.908) 39(-1.75,2.908) 40(-2.25,2.908)
  rect 3.52x2.62 smd: 41(0,0)
VSON-8_L2.0-W1.5-P0.50-BL
  rect 0.25x0.55 smd: 1(-0.75,-0.675) 2(-0.25,-0.675) 3(0.25,-0.675) 4(0.75,-0.675) 5(0.75,0.675) 6(0.25,0.675) 7(-0.25,0.675) 8(-0.75,0.675)
VSSOP-8_L2.4-W2.1-P0.50-LS3.2-BR
  oval 0.75x0.25 smd: 1(1.55,-0.75) 2(1.55,-0.25) 3(1.55,0.25) 4(1.55,0.75) 5(-1.55,0.75) 6(-1.55,0.25) 7(-1.55,-0.25) 8(-1.55,-0.75)
WSON-6_L2.0-W2.0-P0.65-BL-EP
  rect 0.4x0.45 smd: 1(-0.65,-0.975) 2(0,-0.975) 3(0.65,-0.975) 4(0.65,0.975) 5(0,0.975) 6(-0.65,0.975)
  rect 1.6x1 smd: 7(0,0)
WSON-6_L2.0-W2.0-P0.65-BR-EP
  rect 0.45x0.3 smd: 1(0.975,-0.66) 2(0.975,0) 3(0.975,0.66) 4(-0.975,0.66) 5(-0.975,0) 6(-0.975,-0.66)
  rect 1x1.6 smd: 7(0,0)
WSON-8_L6.0-W5.0-P1.27-BL-EP
  oval 0.581x1.276 smd: 1(-1.905,-3.013) 2(-0.635,-3.013) 3(0.635,-3.013) 4(1.905,-3.013) 5(1.905,3.013) 6(0.635,3.013) 7(-0.635,3.013) 8(-1.905,3.013)
  rect 4.3x3.4 smd: 9(0,0)

## Nets
1.1V: C67.2 C72.2 U3.8 U6.2
1.8V: C75.2 U7.1
2.5V: U22.1
3.3V: C16.2 C17.2 C19.2 C20.2 C21.2 C22.2 C23.2 C24.2 C28.2 C30.1 C33.1 C48.1 C49.1 C50.1 C61.1 C74.1 C76.1 C100.2 C101.2 FPC1.15 H3.2 H3.4 H3.10 H3.18 H7.2 H25.2 H26.2 L8.2 R1.2 R2.2 R18.2 R25.2 R26.2 R27.2 R28.2 R40.1 R41.1 R42.1 R43.1 R44.1 R45.1 R56.2 R58.2 R60.2 R62.2 R64.2 R66.2 R68.2 R70.2 R72.2 R74.1 R75.1 R76.1 RJ1.10 RJ1.12 SW1.4 U2.E6 U2.E9 U2.F5 U2.F10 U2.J6 U2.J10 U2.K4 U2.K5 U2.M9 U2.P12 U5.8 U7.4 U7.6 U17.6 U17.19 U18.4 U19.8 U22.4 U22.6 U23.5 U82.1 U87.1 U88.1 U89.1 U94.2 U94.3 U94.5 U94.8
3.3V-1: C12.2 C55.2 U35.1 U86.2 U86.3 U86.5 U86.8
3.3V-2: C96.2 C97.2 U90.2 U90.3 U90.5 U90.8 U91.1
3.3V-3: C98.2 C99.2 U92.2 U92.3 U92.5 U92.8 U93.1
5.0V: C25.2 C26.2 C60.1 C62.1 C63.1 C73.1 H4.1 H5.1 H6.1 L1.2 L11.2 Q1.2 R21.2 R46.1 U2.P6 U23.1 U79.2 U80.2 U81.2
36V: C6.1 C7.2 C8.2 C9.2 C10.2 C11.2 C13.2 C14.2 C15.2 C18.2 C59.2 C68.1 C69.1 C70.1 C81.2 C83.2 C86.1 U1.27 U12.4 U12.5 U20.4 U20.5 U21.4 U21.5 U32.27 U33.27 U34.27 U50.27 U51.27 U52.27 U54.27 U56.27 U83.1
GND: C1.2 C2.2 C3.2 C4.2 C5.2 C6.2 C7.1 C8.1 C9.1 C10.1 C11.1 C13.1 C14.1 C15.1 C16.1 C17.1 C18.1 C19.1 C20.1 C21.1 C22.1 C23.1 C24.1 C25.1 C26.1 C27.1 C28.1 C29.1 C30.2 C31.1 C32.2 C33.2 C34.2 C35.2 C36.1 C37.1 C38.1 C39.1 C40.2 C41.2 C42.2 C43.2 C44.2 C45.2 C46.2 C47.2 C48.2 C49.2 C50.2 C56.2 C57.2 C58.1 C60.2 C61.2 C62.2 C63.2 C65.1 C67.1 C68.2 C69.2 C70.2 C71.1 C72.1 C73.2 C74.2 C75.1 C76.2 C85.2 C86.2 C87.2 C88.2 C89.2 C90.2 C91.2 C92.2 C93.2 C94.2 C95.2 C100.1 C101.1 FPC1.1 FPC1.4 FPC1.7 FPC1.10 FPC1.14 H3.1 H3.5 H3.6 H3.14 H3.22 H4.2 H5.2 H6.2 H7.3 H7.4 H7.5 LED1.1 LED3.1 NOREF#3.1 NOREF#4.1 NOREF#5.1 NOREF#6.1 NOREF#7.1 NOREF#8.1 NOREF#9.1 Q1.1 Q2.2 R3.1 R4.1 R5.1 R6.1 R7.1 R8.2 R9.1 R10.1 R11.2 R12.1 R13.1 R14.1 R15.1 R19.1 R20.1 R29.1 R82.1 R83.1 RJ1.13 RJ1.14 U2.A1 U2.A14 U2.B5 U2.B10 U2.E2 U2.E13 U2.G7 U2.G8 U2.H7 U2.H8 U2.J7 U2.J8 U2.K2 U2.K6 U2.K9 U2.K13 U2.L9 U2.N1 U2.N2 U2.N5 U2.N8 U2.P1 U2.P14 U3.1 U5.4 U7.3 U7.7 U12.10 U12.11 U12.20 U12.32 U12.40 U12.41 U17.9 U17.21 U17.25 U18.6 U18.10 U19.4 U20.10 U20.11 U20.20 U20.32 U20.40 U20.41 U21.10 U21.11 U21.20 U21.32 U21.40 U21.41 U22.3 U22.7 U47.2 U79.1 U80.1 U81.1 U82.3 U87.2 U88.2 U89.2 U94.6 U94.7 U95.2 USB1.5 USB1.6 USB1.7 USB1.8 USB1.9
GND-1: C12.1 C55.1 U35.2 U86.6 U86.7
GND-2: C96.1 C97.1 U90.6 U90.7 U91.2
GND-3: C98.1 C99.1 U92.6 U92.7 U93.2
VDD_SOC_IN: C40.1 C41.1 C42.1 C43.1 L4.2 U2.F6 U2.F7 U2.F8 U2.F9 U2.G6 U2.G9 U2.H6 U2.H9 U2.J5 U2.J9
VDDA_ADC_3P3: H7.16 U2.N14
$1I69294\A1-VCO: H3.3 R48.2
$1I69294\A1-VSI: H3.7 R49.2
$1I69294\A1-VTEM: H3.8 R47.2
$1I69294\A2-VCO: H3.11 R51.2
$1I69294\A2-VSI: H3.15 R52.2
$1I69294\A2-VTEM: H3.16 R50.2
$1I69294\A3-VCO: H3.19 R54.2
$1I69294\A3-VSI: H3.23 R55.2
$1I69294\A3-VTEM: H3.24 R53.2
$1I69294\G-CS-1: U35.4 U86.12
$1I69294\G-CS-2: U90.12 U91.4
$1I69294\G-CS-3: U92.12 U93.4
$1I69294\MISO-SDO-1: U35.3 U86.1
$1I69294\MISO-SDO-2: U90.1 U91.3
$1I69294\MISO-SDO-3: U92.1 U93.3
$1I69294\MOSI-SDI-1: U35.5 U86.14
$1I69294\MOSI-SDI-2: U90.14 U91.5
$1I69294\MOSI-SDI-3: U92.14 U93.5
$1I69294\SCLK-1: U35.7 U86.13
$1I69294\SCLK-2: U90.13 U91.7
$1I69294\SCLK-3: U92.13 U93.7
$1I78243\$1N2148: C84.2 U20.2
$1I78243\$1N2149: C83.1 U20.3
$1I78243\$1N2150: C84.1 U20.1
$1I78243\$1N2153: C81.1 U12.3
$1I78243\$1N2154: C82.2 U12.2
$1I78243\$1N2155: C82.1 U12.1
$1I78243\$1N2170: C59.1 U21.3
$1I78243\$1N2171: C66.1 U21.1
$1I78243\$1N2172: C66.2 U21.2
$1I78243\$1N6352: C3.1 U21.24
$1I78243\$1N6618: C4.1 U21.33
$1I78243\$1N6708: C5.1 U12.33
$1I78243\$1N6714: C85.1 U12.24
$1I78243\$1N9886: U32.3 U32.4 U32.5 U32.6 U32.7 U32.8 U32.9 U32.10 U32.11 U49.1
$1I78243\$1N10035: U33.3 U33.4 U33.5 U33.6 U33.7 U33.8 U33.9 U33.10 U33.11 U49.2
$1I78243\$1N10055: U34.3 U34.4 U34.5 U34.6 U34.7 U34.8 U34.9 U34.10 U34.11 U49.3
$1I78243\$1N10902: U50.3 U50.4 U50.5 U50.6 U50.7 U50.8 U50.9 U50.10 U50.11 U53.1
$1I78243\$1N10928: U52.3 U52.4 U52.5 U52.6 U52.7 U52.8 U52.9 U52.10 U52.11 U53.3
$1I78243\$1N10963: U51.3 U51.4 U51.5 U51.6 U51.7 U51.8 U51.9 U51.10 U51.11 U53.2
$1I78243\$1N15383: U56.3 U56.4 U56.5 U56.6 U56.7 U56.8 U56.9 U56.10 U56.11 U57.3
$1I78243\$1N15409: U1.3 U1.4 U1.5 U1.6 U1.7 U1.8 U1.9 U1.10 U1.11 U57.2
$1I78243\$1N15447: U54.3 U54.4 U54.5 U54.6 U54.7 U54.8 U54.9 U54.10 U54.11 U57.1
$1I78243\$1N15620: C57.1 U20.24
$1I78243\$1N15622: C56.1 U20.33
$1I78243\M1-GHA: U21.6 U32.1
$1I78243\M1-GHB: U21.15 U33.1
$1I78243\M1-GHC: U21.16 U34.1
$1I78243\M1-GLA: U21.8 U32.22
$1I78243\M1-GLB: U21.13 U33.22
$1I78243\M1-GLC: U21.18 U34.22
$1I78243\M1-SHA: U21.7 U32.2
$1I78243\M1-SHB: U21.14 U33.2
$1I78243\M1-SHC: U21.17 U34.2
$1I78243\M1-SPA: R3.2 U21.9 U32.12 U32.13 U32.14 U32.15 U32.16 U32.17 U32.18 U32.19 U32.20
$1I78243\M1-SPB: R14.2 U21.12 U33.12 U33.13 U33.14 U33.15 U33.16 U33.17 U33.18 U33.19 U33.20
$1I78243\M1-SPC: R10.2 U21.19 U34.12 U34.13 U34.14 U34.15 U34.16 U34.17 U34.18 U34.19 U34.20
$1I78243\M2-GHA: U12.6 U50.1
$1I78243\M2-GHB: U12.15 U51.1
$1I78243\M2-GHC: U12.16 U52.1
$1I78243\M2-GLA: U12.8 U50.22
$1I78243\M2-GLB: U12.13 U51.22
$1I78243\M2-GLC: U12.18 U52.22
$1I78243\M2-SHA: U12.7 U50.2
$1I78243\M2-SHB: U12.14 U51.2
$1I78243\M2-SHC: U12.17 U52.2
$1I78243\M2-SPA: R6.2 U12.9 U50.12 U50.13 U50.14 U50.15 U50.16 U50.17 U50.18 U50.19 U50.20
$1I78243\M2-SPB: R5.2 U12.12 U51.12 U51.13 U51.14 U51.15 U51.16 U51.17 U51.18 U51.19 U51.20
$1I78243\M2-SPC: R4.2 U12.19 U52.12 U52.13 U52.14 U52.15 U52.16 U52.17 U52.18 U52.19 U52.20
$1I78243\M3-GHA: U20.6 U54.1
$1I78243\M3-GHB: U1.1 U20.15
$1I78243\M3-GHC: U20.16 U56.1
$1I78243\M3-GLA: U20.8 U54.22
$1I78243\M3-GLB: U1.22 U20.13
$1I78243\M3-GLC: U20.18 U56.22
$1I78243\M3-SHA: U20.7 U54.2
$1I78243\M3-SHB: U1.2 U20.14
$1I78243\M3-SHC: U20.17 U56.2
$1I78243\M3-SPA: R15.2 U20.9 U54.12 U54.13 U54.14 U54.15 U54.16 U54.17 U54.18 U54.19 U54.20
$1I78243\M3-SPB: R20.2 U1.12 U1.13 U1.14 U1.15 U1.16 U1.17 U1.18 U1.19 U1.20 U20.12
$1I78243\M3-SPC: R7.2 U20.19 U56.12 U56.13 U56.14 U56.15 U56.16 U56.17 U56.18 U56.19 U56.20
$1I162614\$1N1285: Q2.3 R23.2
$1I162614\$1N1792: R82.2 U3.5
$1I162614\$1N1953: C65.2 L1.1 U3.2 U3.4
$1I162614\$1N2025: R83.2 U3.3
$1I162614\$1N2131: U3.7 U6.1
$1I162614\CAM_CLK_N: FPC1.8
$1I162614\CAM_CLK_P: FPC1.9
$1I162614\CAM_D0_N: FPC1.2
$1I162614\CAM_D0_P: FPC1.3
$1I162614\CAM_D1_N: FPC1.5
$1I162614\CAM_D1_P: FPC1.6
$1I162614\CAM_EN: Q2.1
$1I162614\I2C_SCL: U4.6
$1I162614\I2C_SCL_1V8: FPC1.13 U4.3
$1I162614\I2C_SDA: U4.5
$1I162614\I2C_SDA_1V8: FPC1.12 U4.4
ANG1-VCO: C88.1 R48.1 U2.M13
ANG1-VSI: C89.1 R49.1 U2.L12
ANG1-VTEM: C87.1 R47.1 U2.K10
ANG2-VCO: C91.1 R51.1 U2.K11
ANG2-VSI: C92.1 R52.1 U2.J12
ANG2-VTEM: C90.1 R50.1 U2.J11
ANG3-VCO: C94.1 R54.1 U2.J13
ANG3-VSI: C95.1 R55.1 U2.L13
ANG3-VTEM: C93.1 R53.1 U2.H13
BOOT_MODE0: H25.1 R8.1 U2.G14
BOOT_MODE1: H26.1 R9.2 U2.F11
CCM_CLK1_N: H7.20 U2.P13
CCM_CLK1_P: H7.18 U2.N13
ENC1A: R42.2 U2.B1 U81.3
ENC1B: R43.2 U2.A5 U81.4
ENC2A: R41.2 U2.F2 U79.3
ENC2B: R44.2 U2.C3 U79.4
ENC3A: R40.2 U2.E4 U80.3
ENC3B: R45.2 U2.E5 U80.4
ETH-LED1: R17.2 U17.4
ETH-LED2: R16.2 U17.2
ETH_CRS_DV: U2.C12 U17.20
ETH_INTR: U2.E11 U17.3
ETH_MDC: U2.C14 U17.16
ETH_MDIO: U2.B14 U17.15
ETH_RST_N: U2.E10 U17.5
ETH_RX_D0: U2.E12 U17.18
ETH_RX_D1: U2.D12 U17.17
ETH_RX_ER: U2.C13 U17.22
ETH_TX_D0: U2.B12 U17.23
ETH_TX_D1: U2.A12 U17.24
ETH_TX_EN: U2.A13 U17.1
ETH_XI: U2.B13 U17.13
GYRO-CS-1: U2.A6 U87.4
GYRO-CS-2: U2.A4 U88.4
GYRO-CS-3: U2.A3 U89.4
GYRO-CS-4: H7.17 U2.B7 U94.12
I2C_SCL: H7.10 U2.P2
I2C_SDA: H7.8 U2.N3
M1-HALL-A: R57.1 U2.E7
M1-HALL-B: R61.1 U2.E8
M1-HALL-C: R59.1 U2.D14
M1-INHA: U2.G2 U21.34
M1-INHB: U2.D2 U21.36
M1-INHC: U2.A2 U21.38
M1-INLA: U2.D3 U21.35
M1-INLB: U2.B3 U21.37
M1-INLC: U2.D1 U21.39
M1-SOA: U2.H12 U21.23
M1-SOB: U2.K14 U21.22
M1-SOC: U2.L14 U21.21
M1-SSCS: U2.B8 U21.29
M2-HALL-A: R63.1 U2.D13
M2-HALL-B: R67.1 U2.D8
M2-HALL-C: R65.1 U2.D9
M2-INHA: U2.H5 U12.34
M2-INHB: U2.H3 U12.36
M2-INHC: U2.G1 U12.38
M2-INLA: U2.H4 U12.35
M2-INLB: U2.C2 U12.37
M2-INLC: U2.G3 U12.39
M2-SOA: U2.H14 U12.23
M2-SOB: U2.L10 U12.22
M2-SOC: U2.G12 U12.21
M2-SSCS: U2.B9 U12.29
M3-HALL-A: R69.1 U2.C11
M3-HALL-B: R73.1 U2.C9
M3-HALL-C: R71.1 U2.C10
M3-INHA: U2.E1 U20.34
M3-INHB: U2.C5 U20.36
M3-INHC: U2.C4 U20.38
M3-INLA: U2.C6 U20.35
M3-INLB: U2.D5 U20.37
M3-INLC: U2.D4 U20.39
M3-SOA: U2.J14 U20.23
M3-SOB: U2.M12 U20.22
M3-SOC: U2.L11 U20.21
M3-SSCS: U2.A8 U20.29
MX-ENABLE: U2.A9 U12.30 U20.30 U21.30
MX-FAULT: U2.A10 U12.25 U20.25 U21.25
MX-MISO-SDO: R74.2 U2.G4 U12.26 U20.26 U21.26 U87.3 U88.3 U89.3 U94.1
MX-MOSI-SDI: R75.2 U2.F4 U12.27 U20.27 U21.27 U87.5 U88.5 U89.5 U94.14
MX-SCLK: R76.2 R81.2 U12.28 U20.28 U21.28 U87.7 U88.7 U89.7 U94.13
ONOFF: H28.1 U2.M6
PMIC_ON_REQ: R1.1 U2.K7 U23.3
POR_B: C32.1 R29.2 SW1.2 U2.M7
SD-CLK: U2.J3 U18.5
SD-CMD: R26.1 U2.J4 U18.3
SD-DAT0: R27.1 U2.J1 U18.7
SD-DAT1: R28.1 U2.K1 U18.8
SD-DAT2: R18.1 U2.H2 U18.1
SD-DAT3: R25.1 U2.J2 U18.2
SD_B1_01: H28.2 U2.M5
SD_B1_06: U2.L3 U19.1
SD_B1_07: U2.L4 U19.6
SD_B1_08: U2.P3 U19.5
SD_B1_09: U2.N4 U19.2
SD_B1_10: U2.P4 U19.3
SD_B1_11: U2.P5 U19.7
SPARE_IO-1_AD: H7.1 U2.K12
SPARE_IO-5: H7.9 U2.B2
SPARE_IO-6: H7.11 U2.B4
SPARE_IO-7: H7.13 U2.B6
SPARE_IO-8: H7.15 U2.C7
SPARE_IO-10: H7.19 R78.1 R79.1 U2.A7
SPARE_IO-11: H7.6 U2.C1
SPI2-SCK: H7.12 R80.2
SPI2-SDI: H7.14 U2.H11
SPI2-SDO: H7.7 U2.H10
UART_RX1: U2.G11 U82.2
UART_TX1: U2.M11 U82.4
USB_D+: U2.L8 USB1.3
USB_D-: U2.M8 USB1.2
USB_VBUS+5V_EXT: C27.2 H24.2 USB1.1
USB_VBUS+5V_INT: U2.N6
$1N3321: H24.1 L9.1
$1N5282: C31.2 U2.M10
$1N5709: R2.1 U18.9
$1N7252: C29.2 U2.K8
$1N9248: C34.1 U2.N11 X4.1
$1N9253: C35.1 R11.1 U2.P11 X4.2
$1N9641: C2.1 U2.P9 U66.2
$1N9645: C1.1 U2.N9 U66.1
$1N14387: R12.2 U2.K3
$1N14683: C36.2 C37.2 U2.P10
$1N14841: C38.2 C39.2 U2.P8
$1N15470: L4.1 U2.M1 U2.M2
$1N15653: C44.1 C45.1 C46.1 C47.1 L8.1 U2.L1 U2.L2
$1N17011: R13.2 U17.14
$1N19196: C53.2 U17.11
$1N19200: C51.2 U17.10
$1N19206: C52.2 U17.8
$1N19216: C54.2 U17.7
$1N19436: C53.1 RJ1.1
$1N19440: C51.1 RJ1.2
$1N19446: C52.1 RJ1.3
$1N19456: C54.1 RJ1.6
$1N19713: R17.1 RJ1.11
$1N23826: C64.2 L11.1 U95.6
$1N27405: L9.2 U77.2
$1N27515: C71.2 L7.1 U95.4 U95.5
$1N29938: D4.2 U47.1 U83.2
$1N33418: R19.2 R22.1 U95.3
$1N33422: R21.1 R22.2
$1N42129: Q1.3 U77.1
$1N42286: R16.1 RJ1.9
$1N65671: LED1.2 R46.2
$1N69624: H4.3 R56.1 R57.2
$1N69828: H4.5 R58.1 R59.2
$1N70032: H4.4 R60.1 R61.2
$1N70382: H5.5 R64.1 R65.2
$1N70388: H5.3 R62.1 R63.2
$1N70395: H5.4 R66.1 R67.2
$1N70758: H6.5 R70.1 R71.2
$1N70764: H6.3 R68.1 R69.2
$1N70771: H6.4 R72.1 R73.2
$1N70888: D4.1 U84.1
$1N70894: C58.2 L7.2 U84.2
$1N131056: LED3.2 R78.2 R79.2
$1N154598: R80.1 U2.M14
$1N154686: R81.1 U2.E3
$1N158737: C64.1 U95.1

Pads without a net: FPC1 11 16 17; H3 9 12 13 17 20 21; H4 6; H5 6; H6 6; NOREF 1; NOREF#2 1; NOREF#10 1; R23 1; RJ1 4 5 7 8; SW1 1 3; U1 21 23 24 25 26; U2 A11 B11 C8 D6 D7 D10 D11 E14 F1 F3 F12 F13 F14 G5 G10 G13 H1 L5 L6 L7 M3 M4 N7 N10 N12 P7; U3 6; U4 1 2 7 8; U5 1 2 3 5 6 7 9; U7 2 5; U12 31; U17 12; U19 9; U20 31; U21 31; U22 2 5; U23 2 4; U24 A1 A2 A3 A4 A5 A6 A7 A8 A9 A10 A11 A12 A13 B1 B2 B3 B4 B5 B6 B7 B8 B9 B10 B11 B12 B13 C1 C2 C3 C4 C5 C6 C7 C8 C9 C10 C11 C12 C13 D1 D2 D3 D4 D5 D6 D7 D8 D9 D10 D11 D12 D13 E1 E2 E3 E4 E5 E6 E7 E8 E9 E10 E11 E12 E13 F1 F2 F3 F4 F5 F6 F7 F8 F9 F10 F11 F12 F13 G1 G2 G3 G4 G5 G6 G7 G8 G9 G10 G11 G12 G13 H1 H2 H3 H4 H5 H6 H7 H8 H9 H10 H11 H12 H13 J1 J2 J3 J4 J5 J6 J7 J8 J9 J10 J11 J12 J13 K1 K2 K3 K4 K5 K6 K7 K8 K9 K10 K11 K12 K13 L1 L2 L3 L4 L5 L6 L7 L8 L9 L10 L11 L12 L13 M1 M2 M3 M4 M5 M6 M7 M8 M9 M10 M11 M12 M13 N1 N2 N3 N4 N5 N6 N7 N8 N9 N10 N11 N12 N13; U32 21 23 24 25 26; U33 21 23 24 25 26; U34 21 23 24 25 26; U35 6 8; U50 21 23 24 25 26; U51 21 23 24 25 26; U52 21 23 24 25 26; U54 21 23 24 25 26; U56 21 23 24 25 26; U86 4 9 10 11; U87 6 8; U88 6 8; U89 6 8; U90 4 9 10 11; U91 6 8; U92 4 9 10 11; U93 6 8; U94 4 9 10 11; USB1 4

## Via types
v1: diameter 0.6, hole 0.3, Top Layer to Bottom Layer, 356 vias
v2: diameter 0.4, hole 0.2, Top Layer to Bottom Layer, 265 vias
v3: diameter 0.35, hole 0.15, Top Layer to Bottom Layer, 1 via
v4: diameter 0.25, hole 0.15, Top Layer to Bottom Layer, 2 vias

## Routing (per net, layer and track width the routed paths; a pad name or vN(x,y) marks a point on that pad's centre or on a via; arc(x,y) is an arc through that point)
3.3V: length 79.7
  Top Layer w0.127: R66.2 17.66,35 v1(17.61,35.05) ; U94.2 U94.3 ; 19.3,26.06 19.89,26.06 R64.2 ; 19.3,26.06 19.3,26.05 v1(19.3,24.97) ; 19.3,26.06 R62.2 ; 17.02,46.89 17.02,47.67 17.09,47.75 v1(15.29,47.75) ; 40.76,50.48 41.16,50.09 v2(41.16,49.75) U94.8 ; 15.14,60.96 15.57,61.39 ; U94.5 42.83,48.64 43,48.47 43.5,48.47 ; 18.92,36.73 19.53,36.12 v1(19.53,36.1) ; R74.1 R75.1 R76.1 ; C49.1 v2(29.3,16.76) ; v1(79.45,9.04) 79.47,9.02 SW1.4 ; 21.03,47.75 21.03,46.94
  Top Layer w0.2: U17.19 v2(29.3,16.76)
  Top Layer w0.25: v2(44.82,48.61) 44.68,48.47 U94.3
  Top Layer w0.3: 89.28,18.03 v1(89.28,18.99) ; C33.1 70.19,9.4 v1(68.88,9.4) ; v1(80.65,17.57) 80.73,17.65 R2.2 ; R18.2 v1(93.47,17.15) ; U17.6 24.19,18.99 v1(23.62,19.56) ; U18.4 88.31,16.47 87.79,16.98 C30.1 88.52,18.16 88.72,17.96 90.35,17.96 ; v2(44.82,32.33) v2(44.02,31.53) ; v1(82.98,18.59) R28.2 R27.2
  Top Layer w0.5: 56.32,8.88 56.32,8.7 56.94,8.09 56.94,7.42 57.4,7.42 57.76,7.06 59.34,7.06 C17.2 ; C33.1 70.21,10.8 U19.8
  Top Layer w0.8: C17.2 v1(59.45,8.77) ; C16.2 v1(58.3,8.74)
  Inner2 w0.6: H7.2 117.59,71.1 109.12,62.64 109.12,51.82 v1(107.85,50.55)
  Inner2 w0.8: v1(107.85,50.55) v1(108.86,50.55)
  Inner3 w0.3: v2(40.82,29.13) 38.79,29.13 38.59,29.34 35.6,29.34 34.97,29.97 v2(34.24,29.97)
  Inner3 w0.5: v2(39.22,35.53) 39.22,35.25 39.92,34.54 41.01,34.54 v2(41.62,33.93)
  vias: v2(31.62,15.58) v2(35.51,22.48) v2(39.03,40.35) v2(40.82,31.53) v2(40.81,20.74) v2(41.62,28.33) v2(44.02,28.33) v2(44.82,29.13) v2(45.62,32.33) v2(47.33,23.44) v2(51.69,32.64) v2(56.76,42.46) v2(56.92,40.94)
3.3V-1: length 13.4
  Top Layer w0.127: 117.86,3.82 117.67,3.63 117.67,3.23 ; 117.86,3.82 117.86,4.58 118.67,5.39 118.67,5.58 ; 117.86,3.82 118.13,3.82 118.17,3.78
  Top Layer w0.25: 120.21,6.35 119.88,6.35 119.12,5.58 118.67,5.58 ; 119.18,3.01 119.18,3.57 118.85,3.91 118.3,3.91 118.17,3.78 118.17,3.23 ; 119.18,3.01 119.49,2.7 120.19,2.7 120.21,2.72 ; 119.18,3.01 119.18,2.85 119.03,2.7 115.18,2.7 U35.1
3.3V-2: length 13.4
  Top Layer w0.127: 118.55,20.07 118.51,20.11 118.24,20.11 ; 118.05,19.52 118.05,19.92 118.24,20.11 ; 118.24,20.11 118.24,20.87 119.05,21.68 119.05,21.87
  Top Layer w0.25: 120.59,19.01 120.57,18.99 119.87,18.99 119.56,19.3 ; 119.56,19.3 119.56,19.15 119.41,18.99 115.56,18.99 U91.1 ; 119.56,19.3 119.56,19.87 119.23,20.2 118.69,20.2 118.55,20.07 118.55,19.52 ; 119.05,21.87 119.5,21.87 120.26,22.64 120.59,22.64
3.3V-3: length 13.4
  Top Layer w0.127: U92.2 118.07,35.52 118.26,35.71 ; U92.8 119.07,37.29 118.26,36.47 118.26,35.71 ; 118.26,35.71 118.53,35.71 118.57,35.67
  Top Layer w0.25: U93.1 115.58,34.59 119.43,34.59 119.58,34.75 119.58,34.9 ; U92.3 118.57,35.67 118.71,35.8 U92.5 119.58,35.47 119.58,34.9 ; 119.58,34.9 119.89,34.59 120.59,34.59 C98.2 ; U92.8 119.52,37.48 120.28,38.24 C99.2
5.0V: length 79
  Top Layer w0.4: 43.95,36.67 44.02,36.67 U2.P6
  Top Layer w0.5: C60.1 C63.1 11.48,28.91 L11.2 ; H4.1 16.21,39.66 ; 52.4,8.89 53.1,8.19 C26.2 54.7,7.39 U23.1
  Top Layer w0.6: C25.2 44.62,38.88 44.08,38.34 44.08,37.6 43.94,37.46 43.94,36.89 43.84,36.78 43.95,36.67
  Top Layer w0.8: v1(52.98,14.73) 52.98,9.48 52.4,8.89
  Inner3 w0.6: v1(44.24,37.85) 43.1,37.85 42.21,36.96 37.25,36.96 36.62,37.59 34.46,37.59 33.7,36.83
  Inner3 w0.8: v1(52.98,14.73) 74.02,14.73 75.18,13.56 97.08,13.56 v1(98.4,14.88)
  vias: v2(44.62,39.69)
36V:
  vias: v1(24.54,82.6) v1(24.54,81.18) v1(25.55,82.6) v1(25.55,81.18) v1(26.57,82.6) v1(26.57,81.18) v1(27.58,82.6) v1(27.58,81.18) v1(32.28,82.6) v1(32.28,81.18) v1(33.3,82.6) v1(33.3,81.18) v1(34.32,82.6) v1(34.32,81.18) v1(35.33,82.6) v1(35.33,81.18) v1(40.28,82.6) v1(40.28,81.18) v1(41.3,82.6) v1(41.3,81.18) v1(42.32,82.6) v1(42.32,81.18) v1(43.33,82.6) v1(43.33,81.18) v1(50.24,59.99) v1(50.24,59.23) v1(51.66,59.99) v1(51.66,59.23) v1(59.21,82.6) v1(59.21,81.18) v1(60.22,82.6) v1(60.22,81.18) v1(61.24,82.6) v1(61.24,81.18) v1(62.26,82.6) v1(62.26,81.18) v1(66.95,82.6) v1(66.95,81.18) v1(67.97,82.6) v1(67.97,81.18) v1(68.99,82.6) v1(68.99,81.18) v1(70,82.6) v1(70,81.18) v1(74.96,82.62) v1(74.96,81.2) v1(75.97,82.62) v1(75.97,81.2) v1(76.99,82.62) v1(76.99,81.2) v1(78,82.62) v1(78,81.2) v1(83.97,60.6) v1(83.97,59.43) v1(85.4,60.6) v1(85.4,59.43) v1(91.99,82.6) v1(91.99,81.18) v1(93,82.6) v1(93,81.18) v1(94.02,82.6) v1(94.02,81.18) v1(95.03,82.6) v1(95.03,81.18) v1(99.72,82.6) v1(99.72,81.18) v1(100.74,82.6) v1(100.74,81.18) v1(101.75,82.6) v1(101.75,81.18) v1(102.77,82.6) v1(102.77,81.18) v1(107.72,82.6) v1(107.72,81.18) v1(108.74,82.6) v1(108.74,81.18) v1(109.75,82.6) v1(109.75,81.18) v1(110.77,82.6) v1(110.77,81.18) v1(111.91,60.4) v1(111.91,59.39) v1(113.34,60.4) v1(113.34,59.39)
GND: length 129.4
  Top Layer w0.127: C90.2 C91.2 30.25,7.39 H3.14 ; C87.2 C88.2 20.47,5.39 H3.6 ; C93.2 C94.2 40.41,7.51 H3.22 ; U20.11 103.75,66.13 104.06,66.45 104.06,68.12 103.45,68.73 101.88,68.73 101.75,68.86 ; 34.42,68.86 34.54,68.73 36.12,68.73 36.73,68.12 36.73,66.45 36.41,66.13 U21.11 ; v1(45.59,6.1) 45.49,6.2 C95.2 ; v2(42.12,49.85) 42.33,49.64 U94.6 ; v2(42.12,49.85) 42.12,50.21 C101.1 ; v2(42.12,49.85) 41.83,49.55 U94.7 ; 66.23,65.29 66.23,66.13 66.06,66.29 ; v2(104.72,66.14) 104.4,65.82 U20.10 ; U17.21 v2(25.81,17.66) U17.9 ; v2(37.39,66.14) 37.07,65.82 U21.10 ; U12.10 71.38,65.82 v2(71.7,66.14) ; 68.73,68.86 68.86,68.73 70.43,68.73 71.04,68.12 71.04,66.45 70.72,66.13 U12.11 ; v2(24.38,12.06) 24.89,12.57 R13.1 ; 99.25,65.29 99.25,65.75 v2(98.84,66.16) ; C89.2 v1(26.16,7.64) ; U21.20 31.91,66.13 31.75,66.29 ; LED3.1 v1(62.1,10.03)
  Top Layer w0.3: v1(86.7,19.12) C30.2 86.7,17.36 86.11,16.76 86.11,15.21 U18.6 ; v1(70.92,8.64) 71.3,9.01 C33.2
  Top Layer w0.4: 76.16,14.68 v1(77.52,14.68) ; USB1.8 71.34,5.64 USB1.5
  Top Layer w0.5: 12.18,41.69 v1(12.14,41.65) ; 12.18,41.69 13.47,41.69 ; 12.18,41.69 12.59,42.1 12.59,42.17 12.56,42.19 12.56,43.08 12.59,43.11 R19.1 ; C26.1 53.1,5.22 v1(53.65,4.67) ; Q1.1 50.5,9.86 v1(49.84,10.52) ; C16.1 59.42,6.05 59.45,6.08 59.98,6.08 v1(60.55,6.66)
  Inner1 w0.5: 50.44,8.79 52.58,6.66 v1(60.55,6.66)
  Inner2 w0.127: v2(104.72,66.14) 106.55,66.14 108.73,68.33 v2(108.73,70.97) ; v2(71.7,66.14) 73.53,66.14 75.71,68.33 v2(75.71,70.97) ; v2(68.7,68.94) 68.45,69.19 v2(68.45,71.02) ; v2(60.07,70.97) 61.28,70.97 v2(65.96,66.29) ; v2(34.39,68.94) 34.14,69.19 v2(34.14,71.02) ; v2(101.72,68.94) 101.47,69.19 v2(101.47,71.02) ; v2(98.84,66.16) 94.03,70.97 v2(93.09,70.97) ; v2(25.76,70.97) 26.97,70.97 v2(31.65,66.29) ; v2(37.39,66.14) 39.22,66.14 41.4,68.33 v2(41.4,70.97)
  vias: v1(5.3,18.81) v1(5.3,13.81) v1(10.3,93.81) v1(10.3,23.81) v1(10.3,3.81) v1(13.7,30.26) v1(13.7,28.95) v1(15.3,93.81) v1(15.3,73.81) v1(15.3,13.81) v1(15.3,8.81) v1(17.47,69.9) v1(18.49,69.9) v1(18.59,67.97) v1(18.59,66.55) v1(18.7,23.76) v1(19.51,69.9) v1(19.61,67.97) v1(19.61,66.55) v1(20.3,93.81) v1(20.3,73.81) v1(20.3,68.81) v1(20.3,13.81) v1(20.3,3.81) v1(20.52,69.9) v1(20.62,67.97) v1(20.62,66.55) v1(21.54,69.9) v1(21.64,67.97) v1(21.64,66.55) v1(22.56,69.9) v1(22.66,67.97) v1(22.66,66.55) v1(25.3,73.81) v1(25.3,68.81) v1(30.3,3.81) v1(32.72,63.35) v1(32.77,61.42) v1(34.16,62.38) v1(35.61,63.4) v1(35.56,61.42) v1(40.3,73.81) v1(40.3,68.81) v1(40.3,3.81) v1(45.3,3.81) v1(46.99,72.85) v1(46.99,71.42) v1(48.01,72.85) v1(48.01,71.42) v1(49.02,72.85) v1(49.02,71.42) v1(50.04,72.85) v1(50.04,71.42) v1(50.3,73.81) v1(50.3,68.81) v1(50.3,3.81) v1(55.3,73.81) v1(55.3,68.81) v1(55.3,63.81) v1(55.3,58.81) v1(55.3,3.81) v1(60.3,68.81) v1(60.3,3.81) v1(65.3,58.81) v1(65.3,13.81) v1(67.03,63.35) v1(67.08,61.42) v1(68.47,62.38) v1(69.92,63.4) v1(69.87,61.42) v1(75.3,73.81) v1(75.3,68.81) v1(75.3,8.81) v1(75.3,3.81) v1(80.3,8.81) v1(80.3,3.81) v1(81.64,73.61) v1(81.64,72.59) v1(81.64,71.58) v1(81.64,70.56) v1(83.06,73.61) v1(83.06,72.59) v1(83.06,71.58) v1(83.06,70.56) v1(85.3,73.81) v1(85.3,68.81) v1(85.3,8.81) v1(85.3,3.81) v1(86.11,16.66) v1(90.3,73.81) v1(90.3,68.81) v1(90.3,8.81) v1(90.3,3.81) v1(95.3,68.81) v1(95.3,8.81) v1(95.3,3.81) v1(100.05,63.35) v1(100.1,61.42) v1(100.3,73.81) v1(101.5,62.38) v1(102.94,63.4) v1(102.89,61.42) v1(108.31,56.84) v1(108.31,55.83) v1(109.82,56.84) v1(109.82,55.83) v1(114,73.81) v1(114,72.8) v1(114,71.78) v1(114,70.76) v1(115.42,73.81) v1(115.42,72.8) v1(115.42,71.78) v1(115.42,70.76) v2(20.27,59.4) v2(25.15,18.29) v2(25.15,17.02) v2(26.42,18.29) v2(26.42,17.02) v2(28.06,63.19) v2(30.39,16.76) v2(30.39,15.75) v2(31.2,33.58) v2(31.62,16.63) v2(33.15,29.97) v2(33.3,43) v2(34.42,22.48) v2(34.75,43) v2(35.01,48.02) v2(35.01,46.37) v2(36.28,46.32) v2(37.62,35.53) v2(37.62,25.13) v2(38.42,32.33) v2(38.42,28.33) v2(39.03,41.44) v2(40.47,41.1) v2(40.82,25.93) v2(41.62,33.13) v2(41.62,32.33) v2(42.42,34.73) v2(42.42,31.53) v2(42.42,30.73) v2(42.42,29.93) v2(42.46,42.51) v2(42.46,41.06) v2(43.13,21.21) v2(43.22,31.53) v2(43.22,30.73) v2(43.22,29.93) v2(44.02,32.33) v2(44.62,40.68) v2(44.82,49.7) v2(44.82,34.73) v2(44.82,25.93) v2(47.22,34.73) v2(47.22,32.33) v2(47.22,28.33) v2(48.02,35.53) v2(48.02,34.73) v2(48.02,25.13) v2(48.42,23.44) v2(50.01,16.71) v2(50.4,31.88) v2(50.4,31.12) v2(52.34,17.25) v2(52.78,34.8) v2(52.78,32.64) v2(53.67,42.29) v2(53.67,41.28) v2(56.16,45.42) v2(56.66,37.09) v2(56.66,35.95) v2(56.66,34.81) v2(57.85,42.46) v2(62.68,63.17) v2(86.74,20.71) v2(87.63,20.71) v2(95.41,63.11)
GND-1: length 8.5
  Top Layer w0.25: 120.21,3.81 120.21,4.91 ; 120.56,4.91 120.76,4.71 v1(121.49,4.71) 121.29,4.91 120.56,4.91 ; 120.56,4.91 120.21,5.26 120.21,4.91 ; 120.56,4.91 120.21,4.91 ; 118.85,4.91 120.21,4.91
  Top Layer w0.3: 118.85,4.41 121.19,4.41 v1(121.49,4.71)
GND-2: length 8.5
  Top Layer w0.25: 120.94,21.2 121.14,21 v1(121.87,21) 121.67,21.2 120.94,21.2 ; 120.94,21.2 120.59,21.2 ; 120.94,21.2 120.59,21.55 120.59,21.2 ; 120.59,21.2 120.59,20.1 ; 120.59,21.2 119.23,21.2
  Top Layer w0.3: 119.23,20.7 121.57,20.7 v1(121.87,21)
